# EasyEDA Pro project ProPrj_FOC Motor Driver _V02.epro, board V02
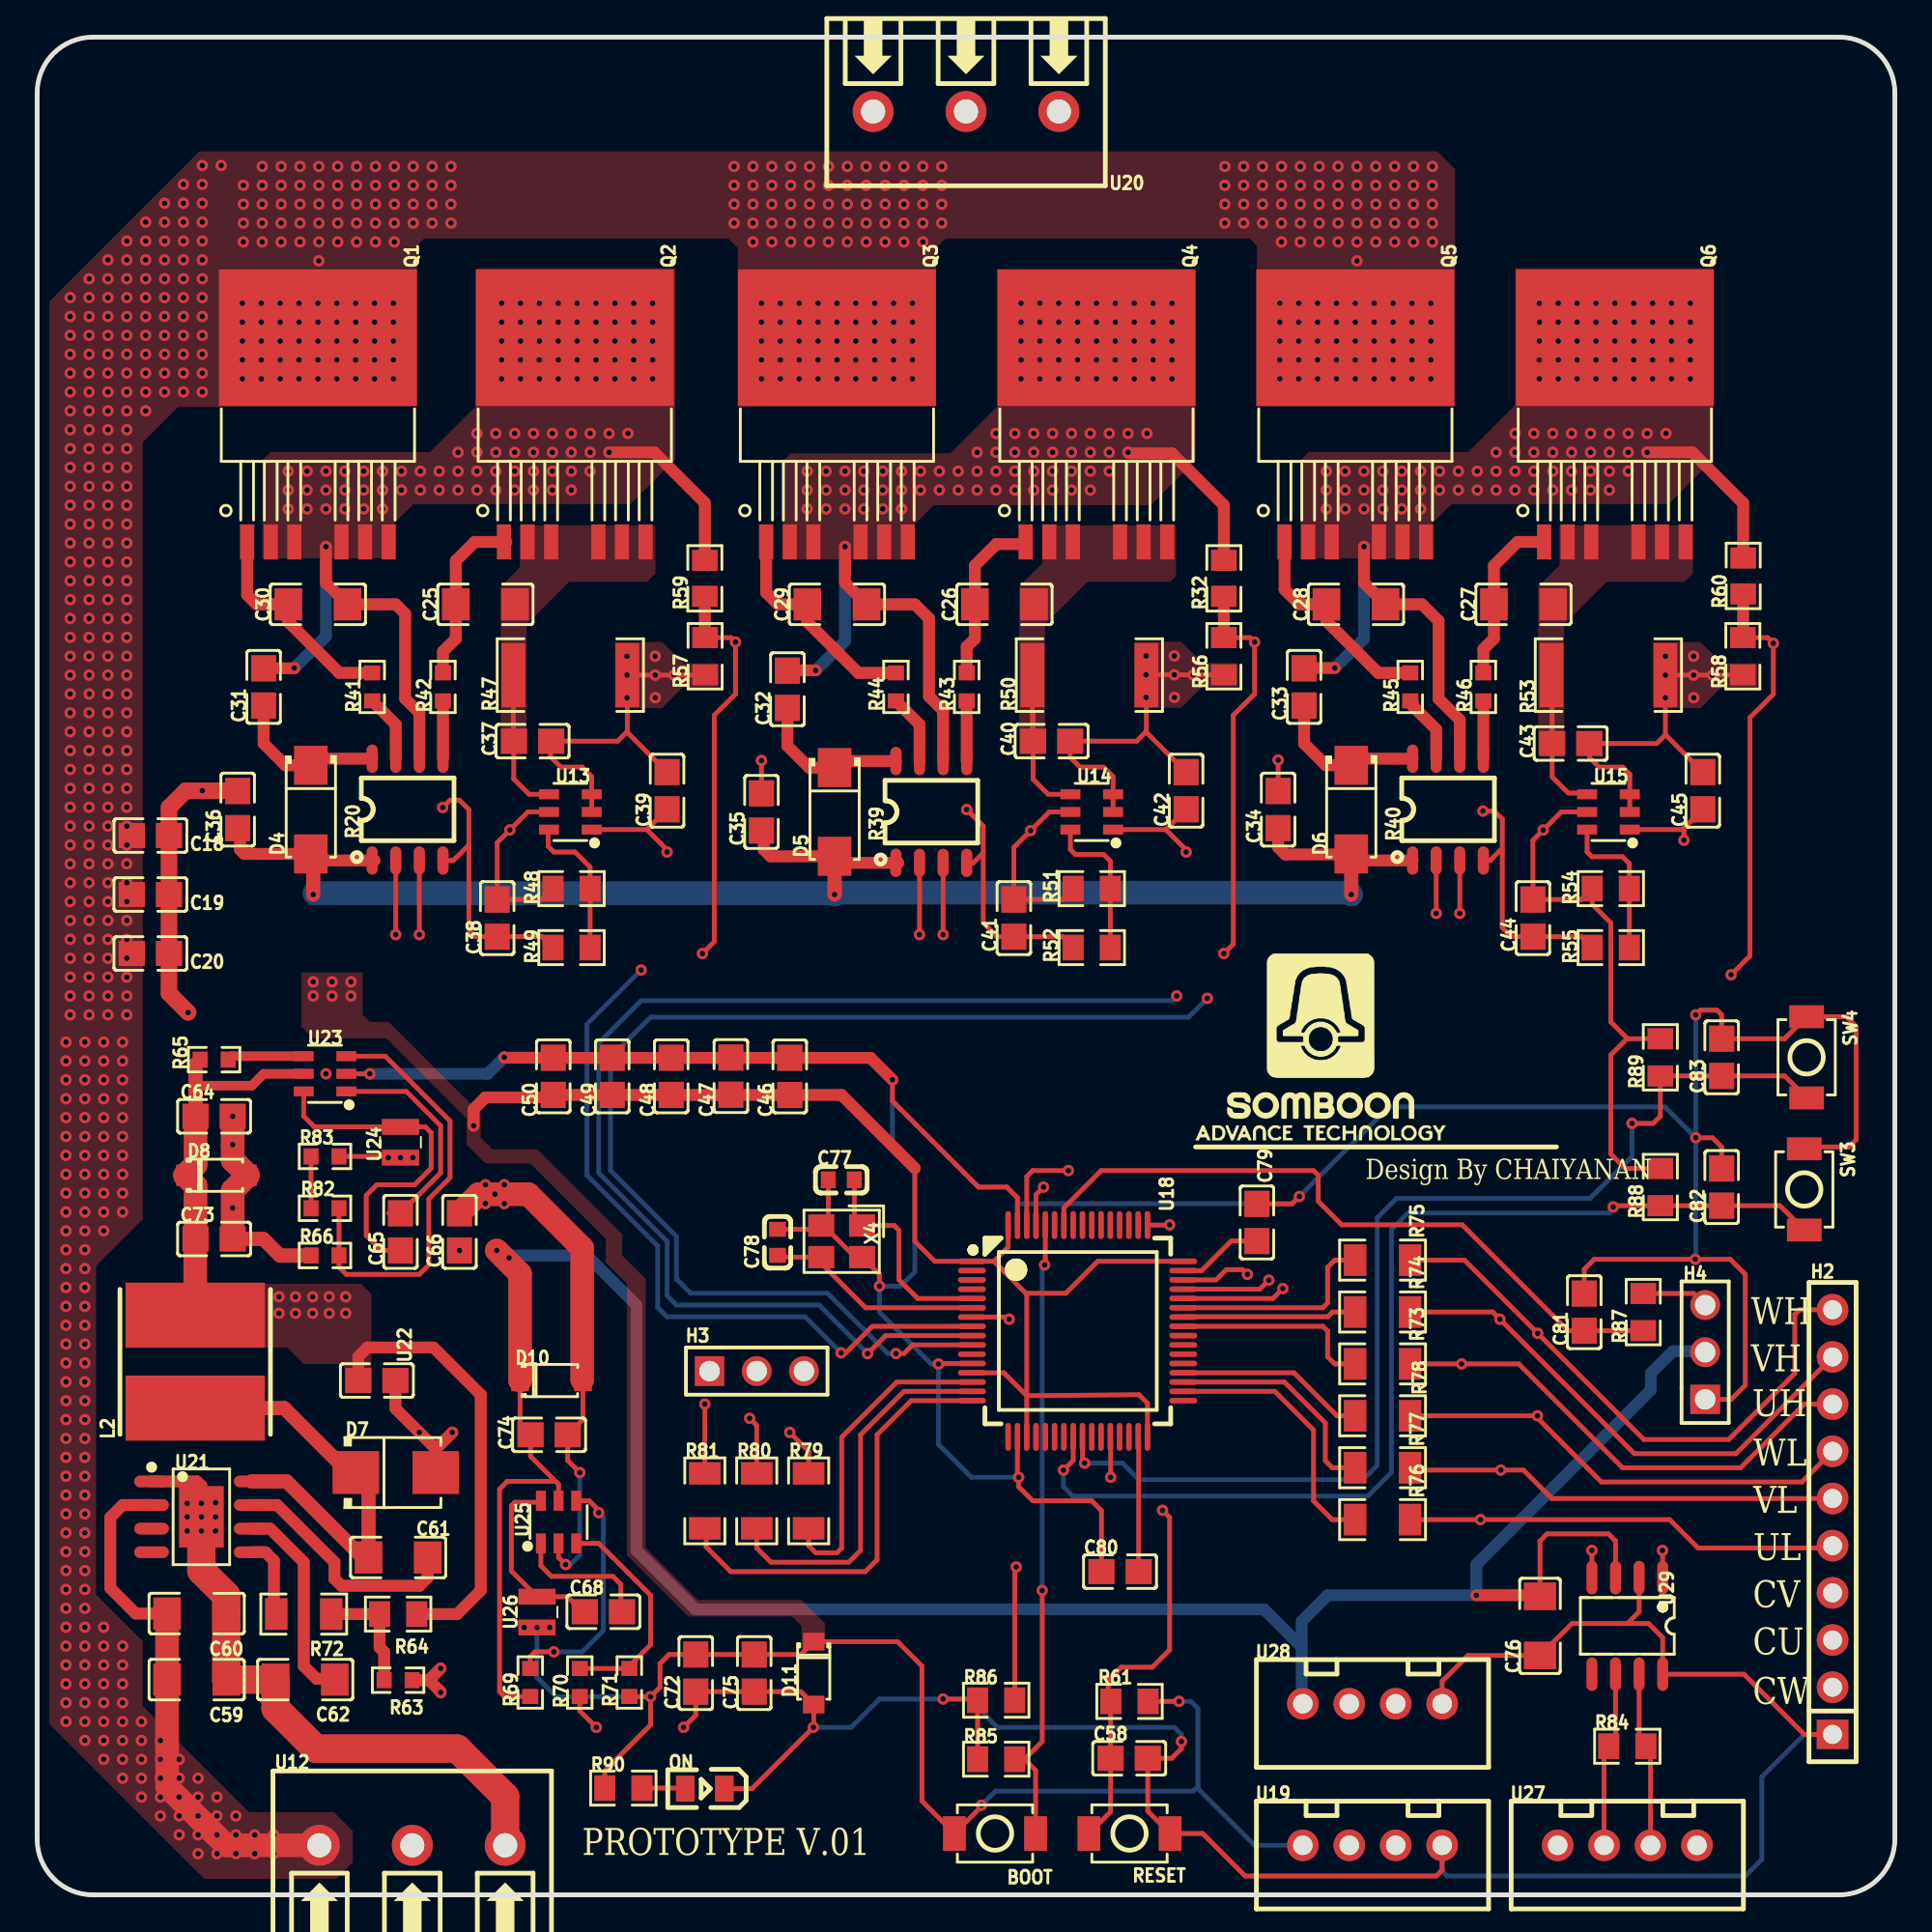
[diagram p10: board, top side]
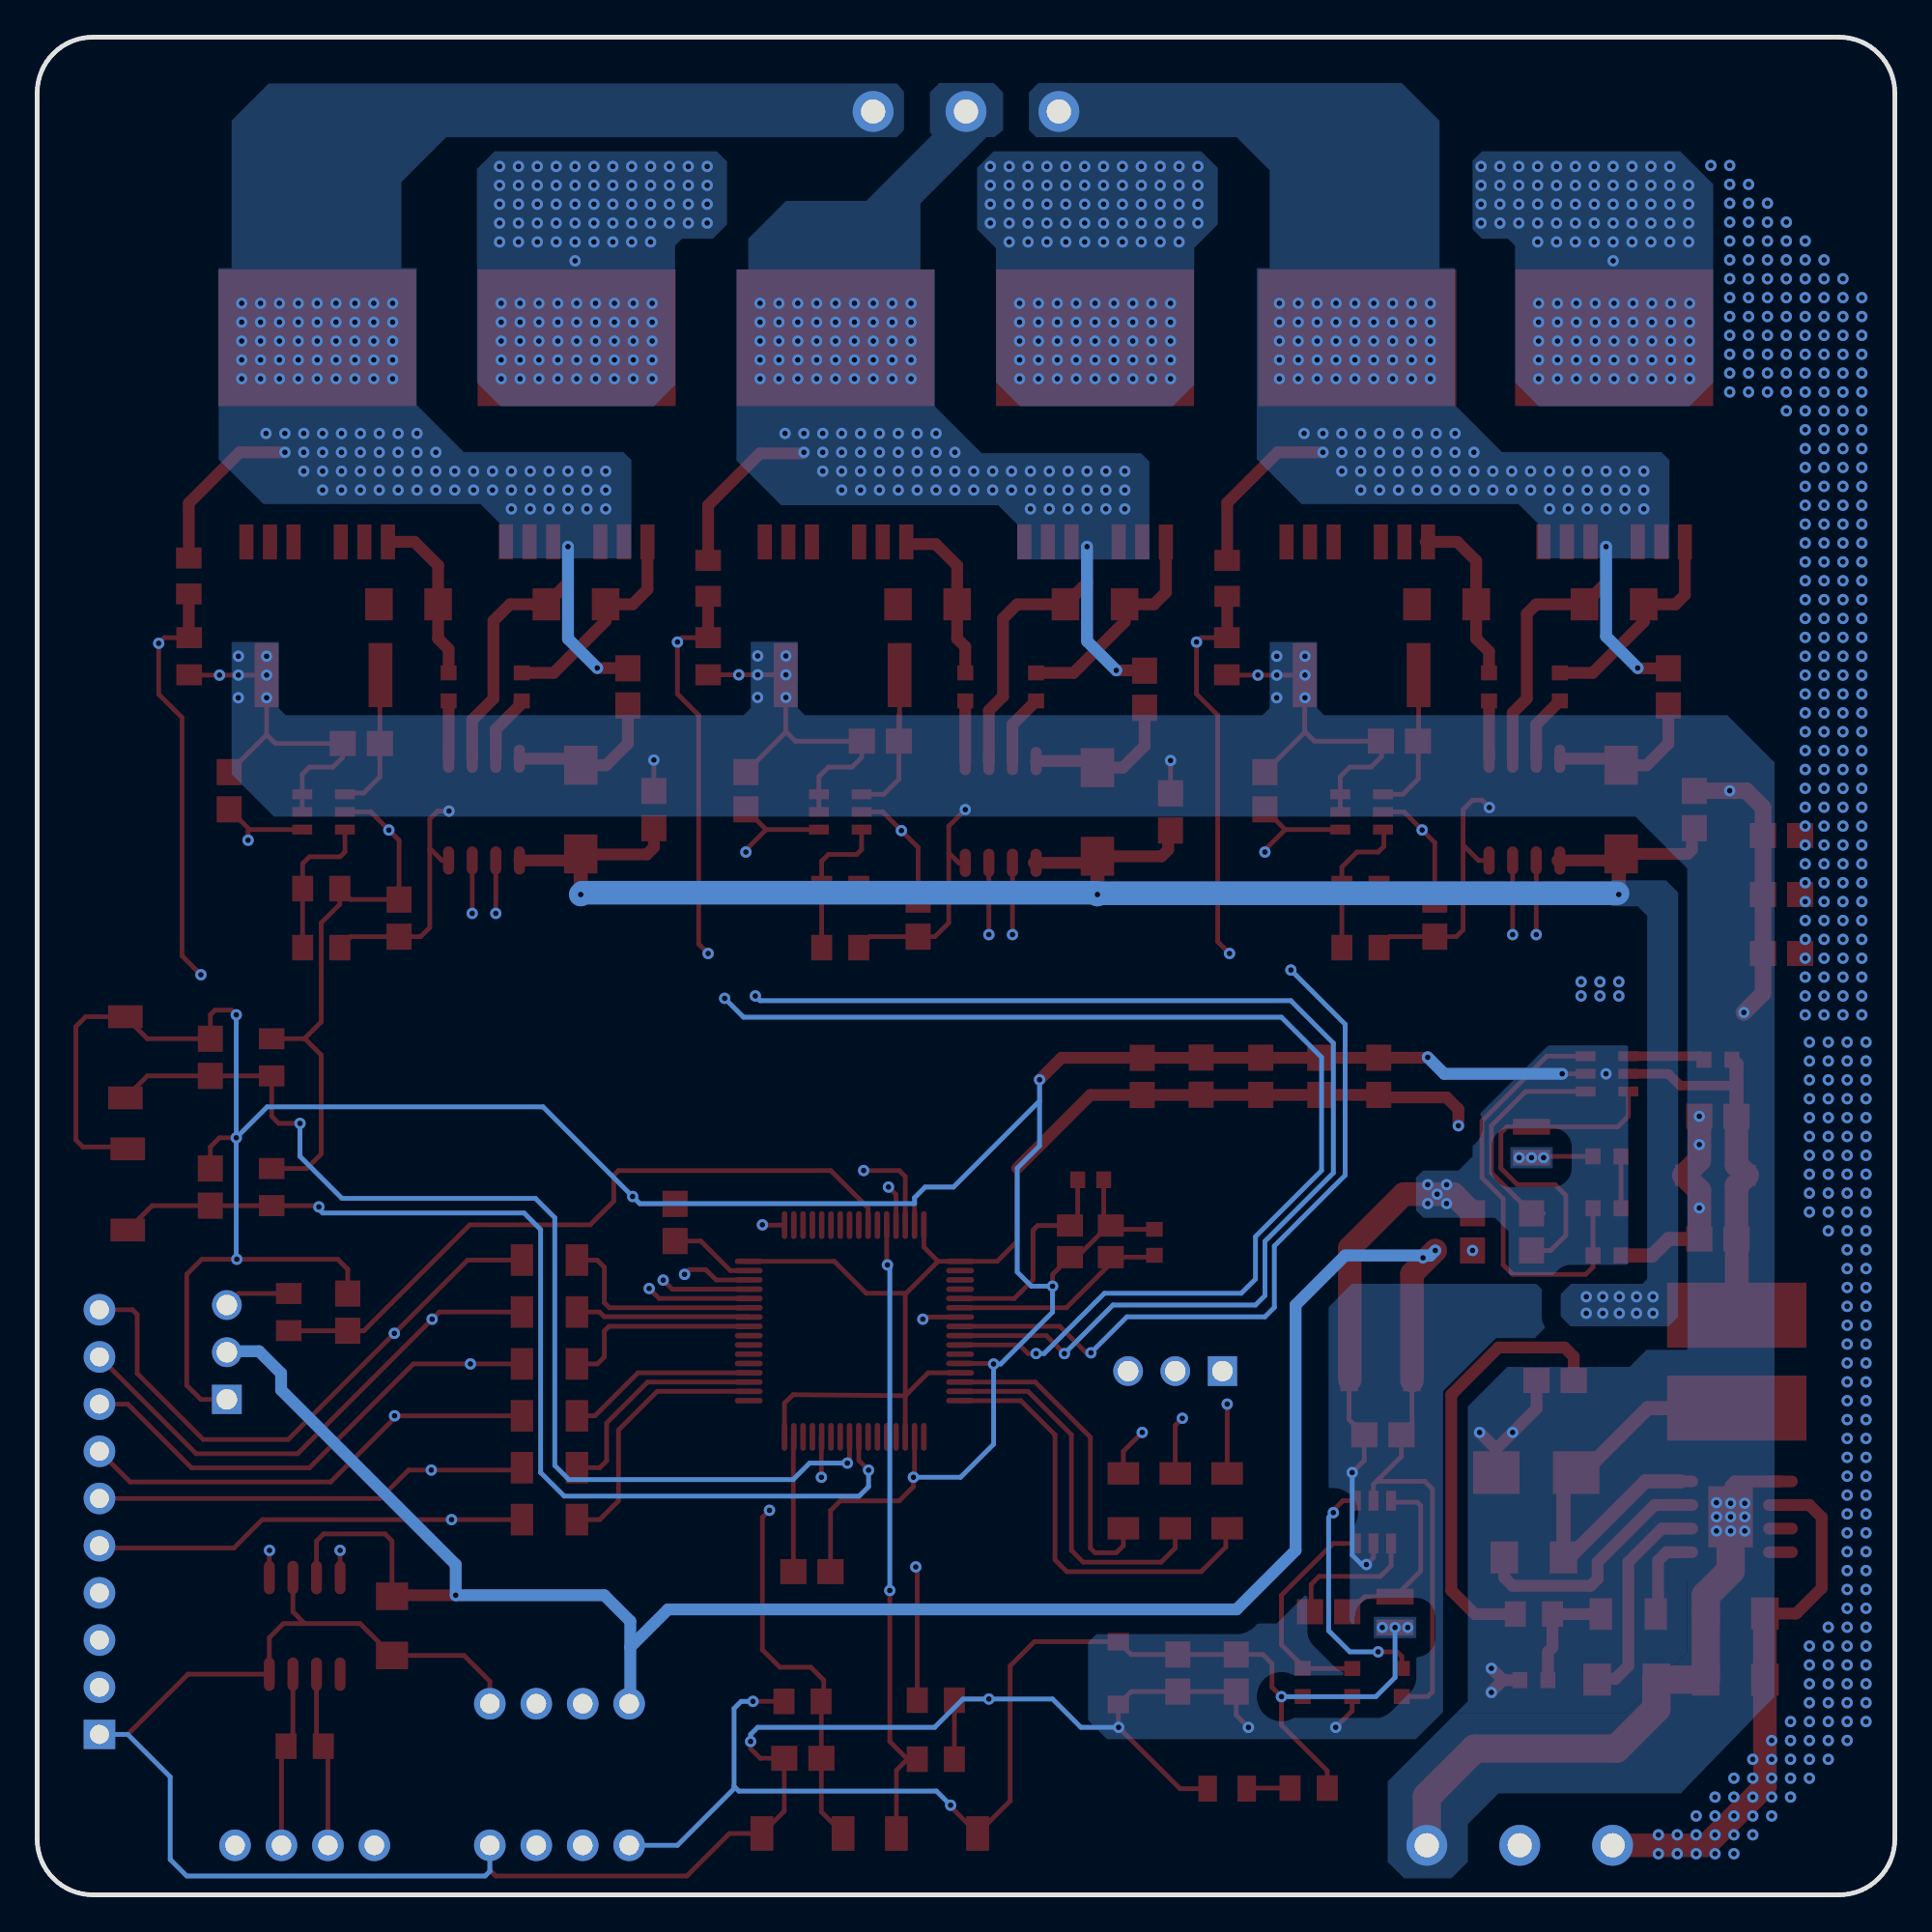
[diagram p11: board, bottom side, seen from below]

Outline 100 x 100 mm; copper layers: Top Layer, Inner1, Inner2, Bottom Layer. Coordinates in mm from the lower left corner of the outline.
Outline path: 0,97 0,3 arc(0.88,0.88) 3,0 97,0 arc(99.12,0.88) 100,3 100,97 arc(99.12,99.12) 97,100 3,100 arc(0.88,99.12) 0,97
Stack: Top Layer 0.012mm / Dielectric1 0.025mm FR4 er 4.5 / Inner1 0.035mm / Dielectric4 0.48mm PP er 4.5 / Inner2 0.035mm / Dielectric5 0.48mm PP er 4.5 / Bottom Layer 0.012mm

## Design rules (mm)
template: Custom Config
spacing copperThickness1oz (default): track to track 0.102, other pairs 0.152 to 0.3
spacing copperThickness2oz: track to track 0.203, other pairs 0.152 to 0.3
track width copperThickness1oz (default): min 0.127, default 0.254, max 2.54
track width copperThickness2oz: min 0.203, default 0.254, max 2.54
differential pair differentialPair (default): width min 0.127, default 0.254, max 2.54; gap min 0.152, default 0.152
via viaSize (default): diameter min 0.5, default 0.61, max 10; hole min 0.3, default 0.305, max 6.3

## Placement (name value [footprint] x y rotation side)
BOOT  TS-1088-AR02016  [SW-SMD_L3.9-W3.0-P4.45]  51.56 3.3 180 top
C18  2.2uF  [C0805]  6.1 57.02 180 top
C19  2.2uF  [C0805]  6.1 53.85 180 top
C20  2.2uF  [C0805]  6.1 50.67 180 top
C25  22nF  [C1206]  24.13 69.47 0 top
C26  22nF  [C1206]  52.07 69.47 0 top
C27  22nF  [C1206]  80.01 69.47 0 top
C28  22nF  [C1206]  70.99 69.47 0 top
C29  22nF  [C1206]  43.05 69.47 0 top
C30  22nF  [C1206]  15.11 69.47 0 top
C31  10uF  [C0805]  12.19 65.02 270 top
C32  10uF  [C0805]  40.39 64.9 270 top
C33  10uF  [C0805]  68.2 65.02 270 top
C34  10uF  [C0805]  66.8 58.42 270 top
C35  10uF  [C0805]  38.99 58.29 270 top
C36  10uF  [C0805]  10.8 58.42 270 top
C37  100nF  [C0805]  26.67 62.1 180 top
C38  100nF  [C0805]  24.77 52.58 90 top
C39  100nF  [C0805]  33.91 59.44 90 top
C40  100nF  [C0805]  54.61 62.1 180 top
C41  100nF  [C0805]  52.58 52.58 90 top
C42  100nF  [C0805]  61.85 59.44 90 top
C43  100nF  [C0805]  82.55 61.98 180 top
C44  100nF  [C0805]  80.52 52.58 90 top
C45  100nF  [C0805]  89.66 59.44 90 top
C46  1uF  [C0805]  40.51 44.06 270 top
C47  1uF  [C0805]  37.34 44.07 270 top
C48  1uF  [C0805]  34.13 44.06 270 top
C49  2.2uF  [C0805]  30.96 44.06 270 top
C50  1uF  [C0805]  27.78 44.06 270 top
C58  100nF  [C0805]  58.78 7.35 0 top
C59  100nF  [C1206]  8.59 11.59 180 top
C60  2.2uF  [C1206]  8.59 15.14 180 top
C61  100nF  [C1206]  19.43 18.16 180 top
C62  2.2uF  [C1206]  14.43 11.59 180 top
C64  4.7uF  [C0805]  9.53 41.91 180 top
C65  22nF  [C0805]  19.56 35.69 270 top
C66  4.7uF  [C0805]  22.73 35.69 270 top
C68  22nF  [C0805]  30.48 15.24 180 top
C72  1uF  [C0805]  35.45 11.94 90 top
C73  22uF  [C0805]  9.53 35.31 180 top
C74  22uF  [C0805]  27.56 24.76 180 top
C75  22uF  [C0805]  38.6 11.94 90 top
C76  2.2uF  [C1206]  80.9 14.48 90 top
C77  18pF  [C0603]  43.29 38.49 180 top
C78  18pF  [C0603]  39.86 35.13 90 top
C79  2.2uF  [C0805]  65.66 36.19 270 top
C80  2.2uF  [C0805]  58.29 17.4 0 top
C81  10nF  [C0805]  83.28 31.37 90 top
C82  100nF  [C0805]  90.68 38.1 270 top
C83  100nF  [C0805]  90.68 45.08 270 top
D4  FR107  [SMA_L4.2-W2.7-LS5.3-FD]  14.73 58.42 90 top
D5  FR107  [SMA_L4.2-W2.7-LS5.3-FD]  42.93 58.29 90 top
D6  FR107  [SMA_L4.2-W2.7-LS5.3-FD]  70.74 58.42 90 top
D7  SS510B  [SMB_L4.3-W3.6-LS5.3-RD]  19.3 22.73 0 top
D8  SMF12A  [SOD-123_L2.8-W1.8-LS3.7-RD]  9.65 38.73 0 top
D10  SMF5.0A  [SOD-123_L2.8-W1.8-LS3.7-RD]  27.69 27.69 0 top
D11  SMF3.3A  [SOD-123_L2.8-W1.8-LS3.7-RD]  41.8 11.94 270 top
H2  XY-PZ2.54V-01-10P  [HDR-TH_10P-P2.54-V-M_4]  96.65 20.07 90 top
H3  2.54-1*3P针  [HDR-TH_3P-P2.54-V-M-1]  38.74 28.19 0 top
H4  2.54-1*3P针  [HDR-TH_3P-P2.54-V-M-1]  89.79 29.21 90 top
L2  68uH  [IND-SMD_L7.8-W7.0_SCD0705N]  8.51 28.7 90 top
ON  KT-0805Y  [LED0805-R-RD]  35.94 5.72 180 top
Q1  IRFS7530TRL7PP  [D2PAK-7_L10.6-W9.6-P1.27-LS15.9-BR]  15.11 78.32 270 top
Q2  IRFS7530TRL7PP  [D2PAK-7_L10.6-W9.6-P1.27-LS15.9-BR]  28.94 78.32 270 top
Q3  IRFS7530TRL7PP  [D2PAK-7_L10.6-W9.6-P1.27-LS15.9-BR]  43.05 78.32 270 top
Q4  IRFS7530TRL7PP  [D2PAK-7_L10.6-W9.6-P1.27-LS15.9-BR]  57.02 78.32 270 top
Q5  IRFS7530TRL7PP  [D2PAK-7_L10.6-W9.6-P1.27-LS15.9-BR]  70.96 78.32 270 top
Q6  IRFS7530TRL7PP  [D2PAK-7_L10.6-W9.6-P1.27-LS15.9-BR]  84.93 78.32 270 top
R20  EG3112D  [SOP-8_L5.0-W3.9-P1.27-LS6.0-BL-1]  19.94 58.42 0 top
R32  56K  [R0805_NEW]  63.88 70.87 90 top
R39  EG3112D  [SOP-8_L5.0-W3.9-P1.27-LS6.0-BL-1]  48.13 58.29 0 top
R40  EG3112D  [SOP-8_L5.0-W3.9-P1.27-LS6.0-BL-1]  75.95 58.42 0 top
R41  10Ω  [R0603]  18.03 65.02 90 top
R42  10Ω  [R0603]  21.84 65.02 90 top
R43  10Ω  [R0603]  50.04 65.02 90 top
R44  10Ω  [R0603]  46.23 65.02 90 top
R45  10Ω  [R0603]  73.91 65.02 90 top
R46  10Ω  [R0603]  77.85 65.02 90 top
R47  1mΩ  [R2512]  28.7 65.66 180 top
R48  1kΩ  [R0805]  28.77 54.17 0 top
R49  1kΩ  [R0805]  28.77 50.99 0 top
R50  1mΩ  [R2512]  56.64 65.66 180 top
R51  1kΩ  [R0805]  56.77 54.17 0 top
R52  1kΩ  [R0805]  56.77 50.99 0 top
R53  1mΩ  [R2512]  84.58 65.66 180 top
R54  1kΩ  [R0805]  84.71 54.17 0 top
R55  1kΩ  [R0805]  84.71 50.99 0 top
R56  2.2kΩ  [R0805]  63.88 66.67 90 top
R57  2.2kΩ  [R0805]  35.96 66.67 90 top
R58  2.2kΩ  [R0805]  91.82 66.67 90 top
R59  56K  [R0805_NEW]  35.94 70.87 90 top
R60  56K  [R0805_NEW]  91.84 71 90 top
R61  10kΩ  [R0805]  58.8 10.41 180 top
R63  30kΩ  [R0603]  19.43 11.56 180 top
R64  274kΩ  [R0805]  19.43 15.11 0 top
R65  10kΩ  [R0603]  9.53 44.96 0 top
R66  10kΩ  [R0603]  15.49 34.42 0 top
R69  10kΩ  [R0603]  26.54 11.43 90 top
R70  10kΩ  [R0603]  29.21 11.43 90 top
R71  45.3kΩ  [R0603]  31.88 11.43 270 top
R72  5.1kΩ  [R1206]  14.35 15.11 0 top
R73  0Ω  [R1206]  72.42 28.58 180 top
R74  0Ω  [R1206]  72.42 31.38 180 top
R75  0Ω  [R1206]  72.42 34.17 180 top
R76  0Ω  [R1206]  72.42 20.2 180 top
R77  0Ω  [R1206]  72.42 22.99 180 top
R78  0Ω  [R1206]  72.42 25.79 180 top
R79  0Ω  [R1206]  41.53 21.21 270 top
R80  0Ω  [R1206]  38.74 21.21 270 top
R81  0Ω  [R1206]  35.94 21.21 270 top
R82  4.3kΩ  [R0603]  15.49 36.96 180 top
R83  73.2kΩ  [R0603]  15.49 39.75 0 top
R84  120Ω  [R0805]  85.6 8 0 top
R85  10kΩ  [R0805]  51.63 7.3 180 top
R86  10kΩ  [R0805]  51.63 10.48 180 top
R87  1kΩ  [R0805]  86.46 31.37 270 top
R88  10kΩ  [R0805]  87.38 38.1 270 top
R89  10kΩ  [R0805]  87.38 45.08 270 top
R90  1kΩ  [R0805]  31.56 5.75 180 top
RESET  TS-1088-AR02016  [SW-SMD_L3.9-W3.0-P4.45]  58.8 3.3 180 top
SW3  TS-1088-AR02016  [SW-SMD_L3.9-W3.0-P4.45]  95.12 37.97 270 top
SW4  TS-1088-AR02016  [SW-SMD_L3.9-W3.0-P4.45]  95.25 45.08 270 top
U12  1935174  [CONN-TH_3P-P5.00_1935174]  20.19 2.67 0 top
U13  INA181A1IDBVR  [SOT-23-6_L2.9-W1.6-P0.95-LS2.8-TL]  28.7 58.29 180 top
U14  INA181A1IDBVR  [SOT-23-6_L2.9-W1.6-P0.95-LS2.8-TL]  56.77 58.29 180 top
U15  INA181A1IDBVR  [SOT-23-6_L2.9-W1.6-P0.95-LS2.8-TL]  84.58 58.29 180 top
U18  STM32F405RGT6  [LQFP-64_L10.0-W10.0-P0.50-LS12.0-BL]  56.01 30.35 270 top
U19  xh2.54-4p(直针)  [CONN-TH_4P-P2.50-XH2.54-4P]  71.88 2.67 0 top
U20  1935174  [CONN-TH_3P-P5.00_1935174]  50 96 180 top
U21  SCT2A23STER  [ESOP-8_L4.9-W3.9-P1.27-LS6.0-BL-EP-1]  8.84 20.35 270 top
U22  68pF  [C0805]  18.29 27.69 180 top
U23  RY8120  [SOT-23-6_L2.9-W1.6-P0.95-LS2.8-BL]  15.49 44.2 90 top
U24  2.2uH  [IND-SMD_L2.5-W2.0-VLS252012CX-150M]  19.56 40.51 270 top
U25  RY8120  [SOT-23-6_L2.9-W1.6-P0.95-LS2.8-BL]  28.07 20.07 0 top
U26  2.2uH  [IND-SMD_L2.5-W2.0-VLS252012CX-150M]  26.91 15.22 270 top
U27  xh2.54-4p(直针)  [CONN-TH_4P-P2.50-XH2.54-4P]  85.6 2.67 0 top
U28  xh2.54-4p(直针)  [CONN-TH_4P-P2.50-XH2.54-4P]  71.88 10.29 0 top
U29  MCP2551-I/SN  [SOIC-8_L4.9-W3.9-P1.27-LS6.0-BL]  85.6 14.48 180 top
X4  8MHz  [CRYSTAL-SMD_4P-L3.2-W2.5-BL]  43.31 35.18 180 top

## Footprints (pads in the part's own frame, mm; a bottom-side part is the same pattern mirrored in y, then rotated)
C0603
  rect 0.8x0.9 smd: 1(-0.7,0) 2(0.7,0)
C0805
  rect 1.41x1.35 smd: 1(-1,0) 2(1,0)
C1206
  rect 1.485x1.728 smd: 1(-1.593,0) 2(1.593,0)
CONN-TH_3P-P5.00_1935174
  round 2.2 hole 1.3: 1(-5,0) 2(0,0) 3(5,0)
CONN-TH_4P-P2.50-XH2.54-4P
  round 1.7 hole 1.05: 1(3.75,0) 2(1.25,0) 3(-1.25,0) 4(-3.75,0)
CRYSTAL-SMD_4P-L3.2-W2.5-BL
  rect 1.4x1.2 smd: 1(-1.1,-0.85) 2(1.1,-0.85) 3(1.1,0.85) 4(-1.1,0.85)
D2PAK-7_L10.6-W9.6-P1.27-LS15.9-BR
  rect 1.887x0.762 smd: 1(5.495,-3.81) 2(5.495,-2.54) 3(5.495,-1.27) 5(5.495,1.27) 6(5.495,2.54) 7(5.495,3.81)
  rect 7.356x10.66 smd: 4(-5.495,0)
ESOP-8_L4.9-W3.9-P1.27-LS6.0-BL-EP-1
  oval 0.63x1.865 smd: 1(-1.905,-2.683) 2(-0.635,-2.683) 3(0.635,-2.683) 4(1.905,-2.683) 5(1.905,2.683) 6(0.635,2.683) 7(-0.635,2.683) 8(-1.905,2.683)
  rect 3.3x2.4 smd: 9(0,0)
HDR-TH_3P-P2.54-V-M-1
  rect 1.575x1.6 hole 1.1: 1(-2.54,0)
  round 1.6 hole 1.1: 2(0,0) 3(2.54,0)
HDR-TH_10P-P2.54-V-M_4
  rect 1.575x1.7 hole 1.02: 1(-11.43,0)
  round 1.7 hole 1.02: 2(-8.89,0) 3(-6.35,0) 4(-3.81,0) 5(-1.27,0) 6(1.27,0) 7(3.81,0) 8(6.35,0) 9(8.89,0) 10(11.43,0)
IND-SMD_L2.5-W2.0-VLS252012CX-150M
  rect 0.85x2 smd: 1(-0.83,0) 2(0.83,0)
IND-SMD_L7.8-W7.0_SCD0705N
  rect 3.5x7.5 smd: 1(-2.5,0) 2(2.5,0)
LED0805-R-RD
  rect 1x1.399 smd: 1(1.05,0) 2(-1.05,0)
LQFP-64_L10.0-W10.0-P0.50-LS12.0-BL
  oval 0.3x1.5 smd: 1(-3.75,-5.688) 2(-3.25,-5.688) 3(-2.75,-5.688) 4(-2.25,-5.688) 5(-1.75,-5.688) 6(-1.25,-5.688) 7(-0.75,-5.688) 8(-0.25,-5.688) 9(0.25,-5.688) 10(0.75,-5.688) 11(1.25,-5.688) 12(1.75,-5.688) 13(2.25,-5.688) 14(2.75,-5.688) 15(3.25,-5.688) 16(3.75,-5.688) 33(3.75,5.688) 34(3.25,5.688) 35(2.75,5.688) 36(2.25,5.688) 37(1.75,5.688) 38(1.25,5.688) 39(0.75,5.688) 40(0.25,5.688) 41(-0.25,5.688) 42(-0.75,5.688) 43(-1.25,5.688) 44(-1.75,5.688) 45(-2.25,5.688) 46(-2.75,5.688) 47(-3.25,5.688) 48(-3.75,5.688)
  oval 1.5x0.3 smd: 17(5.7,-3.738) 18(5.7,-3.238) 19(5.7,-2.738) 20(5.7,-2.238) 21(5.7,-1.738) 22(5.7,-1.238) 23(5.7,-0.739) 24(5.7,-0.238) 25(5.7,0.262) 26(5.7,0.762) 27(5.7,1.262) 28(5.7,1.762) 29(5.7,2.261) 30(5.7,2.762) 31(5.7,3.261) 32(5.7,3.762) 49(-5.7,3.762) 50(-5.7,3.261) 51(-5.7,2.762) 52(-5.7,2.261) 53(-5.7,1.762) 54(-5.7,1.262) 55(-5.7,0.762) 56(-5.7,0.262) 57(-5.7,-0.238) 58(-5.7,-0.739) 59(-5.7,-1.238) 60(-5.7,-1.738) 61(-5.7,-2.238) 62(-5.7,-2.738) 63(-5.7,-3.238) 64(-5.7,-3.738)
R0603
  rect 0.806x0.864 smd: 1(-0.753,0) 2(0.753,0)
R0805
  rect 1.133x1.377 smd: 1(-1,0) 2(1,0)
R0805_NEW
  rect 1.133x1.377 smd: 1(-0.966,0) 2(0.966,0)
R1206
  rect 1.208x1.701 smd: 1(-1.479,0) 2(1.479,0)
R2512
  rect 1.282x3.456 smd: 1(-3.067,0) 2(3.067,0)
SMA_L4.2-W2.7-LS5.3-FD
  rect 2.1x1.8 smd: 1(-2.386,0) 2(2.386,0)
SMB_L4.3-W3.6-LS5.3-RD
  rect 2.5x2.3 smd: 1(-2.15,0) 2(2.15,0)
SOD-123_L2.8-W1.8-LS3.7-RD
  rect 0.95x1.15 smd: 1(-1.692,0) 2(1.692,0)
SOIC-8_L4.9-W3.9-P1.27-LS6.0-BL
  oval 0.588x1.8 smd: 1(-1.905,-2.6) 2(-0.635,-2.6) 3(0.635,-2.6) 4(1.905,-2.6) 5(1.905,2.6) 6(0.635,2.6) 7(-0.635,2.6) 8(-1.905,2.6)
SOP-8_L5.0-W3.9-P1.27-LS6.0-BL-1
  oval 0.6x1.52 smd: 1(-1.905,-2.74) 2(-0.635,-2.74) 3(0.635,-2.74) 4(1.905,-2.74) 5(1.905,2.74) 6(0.635,2.74) 7(-0.635,2.74) 8(-1.905,2.74)
SOT-23-6_L2.9-W1.6-P0.95-LS2.8-BL
  rect 0.532x1.072 smd: 1(-0.95,-1.149) 2(0,-1.149) 3(0.95,-1.149) 4(0.95,1.149) 5(0,1.149) 6(-0.95,1.149)
SOT-23-6_L2.9-W1.6-P0.95-LS2.8-TL
  rect 1.072x0.532 smd: 1(-1.149,0.95) 2(-1.149,0) 3(-1.149,-0.95) 4(1.149,-0.95) 5(1.149,0) 6(1.149,0.95)
SW-SMD_L3.9-W3.0-P4.45
  rect 1.23x1.86 smd: 1(-2.185,0) 2(2.185,0)

## Nets
As in the schematic, except:
3.3V: BOOT.2 C38.2 C41.2 C44.2 C46.2 C47.2 C48.2 C49.2 C50.2 C72.2 C75.2 D11.1 R48.1 R51.1 R54.1 R61.1 R71.2 R88.1 R89.1 R90.2 U13.5 U14.5 U15.5 U18.1 U18.13 U18.19 U18.32 U18.48 U18.64 U19.4 U26.2
AGND: C18.1 C19.1 C20.1 C34.1 C35.1 C36.1 C37.1 C38.1 C39.2 C40.1 C41.1 C42.2 C43.1 C44.1 C45.2 C46.1 C47.1 C48.1 C49.1 C50.1 C58.2 C59.1 C60.1 C62.2 C64.1 C66.1 C72.1 C73.1 C74.1 C75.1 C76.1 C77.2 C78.2 C79.1 C80.1 C81.2 C82.1 C83.1 D7.2 D8.2 D10.2 D11.2 H2.1 H4.1 ON.2 R20.4 R39.4 R40.4 R47.1 R49.1 R50.1 R52.1 R53.1 R55.1 R56.1 R57.1 R58.1 R63.1 R66.1 R70.1 R85.2 R86.2 RESET.1 SW3.1 SW4.1 U12.3 U13.2 U13.3 U14.2 U14.3 U15.2 U15.3 U18.12 U18.18 U18.63 U19.1 U21.1 U21.9 U22.1 U23.2 U25.2 U28.1 U29.2 U29.8 X4.2 X4.4
BOOT: BOOT.1 R85.1 U18.60
RESET: C58.1 R61.2 RESET.2 U18.7
$2N11780: ON.1 R90.1

Pads without a net: U12 2; U18 2 3 4 11 17 20 21 22 23 26 27 29 30 33 37 38 39 40 50 51 52 53 54 55 56 57 59; U21 3 4; U27 1 4; U29 5

## Via types
v1: diameter 0.61, hole 0.305, Top Layer to Bottom Layer, 1126 vias

## Routing (per net, layer and track width the routed paths; a pad name or vN(x,y) marks a point on that pad's centre or on a via; arc(x,y) is an arc through that point)
3.3V: length 261.4
  Top Layer w0.254: 53.22,32.39 53.27,32.34 53.27,26.87 ; 53.22,32.39 51.5,34.1 ; 53.22,32.39 55.37,32.39 57.09,34.1 U18.48 ; 47.24,39.12 47.24,35.18 48.32,34.1 U18.1 51.5,34.1 ; R71.2 31.89,10.67 v1(33.02,10.67) ; 51.5,34.1 52.27,34.87 52.27,36.05 ; 85.61,46.08 85.58,46.08 84.71,45.21 84.71,39.88 85.49,39.1 R88.1 ; 85.61,46.08 84.71,46.99 84.71,52.32 83.71,53.32 R54.1 83.12,53.58 C44.2 80.52,56.77 v1(81.07,57.32) 82.04,58.29 U15.5 ; 85.61,46.08 R89.1 ; R51.1 55.18,53.58 C41.2 52.58,56.39 v1(53.48,57.29) 54.48,58.29 U14.5 ; 53.27,24.65 53.27,26.87 ; 53.27,26.87 59.31,26.92 59.77,26.46 59.77,24.65 ; 53.27,26.87 52.03,28.1 U18.13 ; v1(33.02,10.67) 33.53,11.18 33.53,12.45 34.02,12.94 C72.2 C75.2 41.11,12.94 D11.1 46.31,13.63 47.62,12.32 47.62,5.05 BOOT.2 50.83,4.76 v1(50.83,4.83) ; v1(33.02,10.67) 33.02,9.14 30.56,6.68 R90.2 ; R48.1 27.18,53.58 C38.2 24.77,56.64 v1(25.45,57.32) 26.42,58.29 U13.5 ; v1(61.47,10.41) R61.1
  Top Layer w0.635: v1(23.5,41.4) 23.5,42.29 24.13,42.93 27.65,42.93 C50.2 C49.2 C48.2 34.14,43.06 C46.2 43.3,43.06 47.24,39.12
  Inner2 w0.508: v1(81.07,57.32) 81.04,57.29 v1(53.48,57.29) 53.44,57.32 v1(25.45,57.32)
  Inner2 w0.889: v1(25.45,57.32) 19.99,57.32 15.88,53.21 15.88,49.29
  Bottom Layer w0.254: 62.48,5.84 62.23,5.59 51.59,5.59 v1(50.83,4.83) ; 62.48,5.84 62.48,5.72 65.53,2.67 U19.4 ; 62.48,5.84 62.48,10.03 62.1,10.41 v1(61.47,10.41) ; v1(33.02,10.67) 27.94,10.67 26.91,11.7 v1(26.91,14.39)
  vias: v1(14.86,49.15) v1(14.86,48.39) v1(15.88,49.15) v1(15.88,48.39) v1(16.89,49.15) v1(16.89,48.39) v1(26.22,14.39) v1(27.59,14.39)
12V: length 132.2
  Top Layer w0.508: 8.53,43.35 8.74,43.56 11.56,43.56 12.19,44.2 U23.5
  Top Layer w0.635: 10.92,57.42 10.92,56.26 11.15,56.03 D4.1 14.86,56.03 15.21,55.68 18.16,55.68 ; R64.2 22.61,15.11 23.88,16.38 23.88,26.92 21.34,29.46 17.78,29.46 17.29,28.97 U22.2 ; R40.1 71.09,55.68 D6.1 70.71,56.01 67.18,56.01 66.8,56.39 C34.2 ; 46.35,55.55 43.41,55.55 43.05,55.91 D5.1 39.47,55.91 39.12,56.26 39.12,57.29
  Top Layer w0.762: 14.86,55.91 v1(14.86,53.85) ; D6.1 v1(70.74,53.85) ; R65.1 8.53,44.71 C64.2 ; D5.1 v1(42.93,53.85)
  Top Layer w1.27: L2.2 8.51,35.29 C73.2 8.53,38.17 D8.1 8.53,39.3 C64.2
  Bottom Layer w1.27: 14.93,53.92 42.86,53.92 v1(42.93,53.85) 43.02,53.95 70.64,53.95 v1(70.74,53.85)
  vias: v1(13.02,32.19) v1(13.02,31.31) v1(13.91,32.19) v1(13.91,31.31) v1(14.83,32.19) v1(14.83,31.31) v1(15.72,32.19) v1(15.72,31.31) v1(16.61,32.19) v1(16.61,31.31)
+5V: length 149.5
  Top Layer w0.254: v1(19.56,39.68) 19.49,39.75 R83.2 ; C76.2 80.9,19.05 81.28,19.43 84.58,19.43 84.96,19.05 U29.3 ; 27.91,22.26 25.31,22.26 24.89,21.84 24.89,10.93 25.15,10.68 R69.1 ; 27.91,22.26 26.56,23.61 C74.2 25.99,25.33 D10.1 ; 27.91,22.26 28.07,22.1 U25.5
  Top Layer w0.635: v1(77.47,16.13) 80.84,16.13 C76.2
  Top Layer w1.27: D10.1 25.99,33.43 v1(24.74,34.69)
  Inner2 w1.524: 19.56,39.62 19.56,37.47 22.34,34.69 v1(22.73,34.69) v1(24.74,34.69)
  Bottom Layer w0.635: H4.2 89.74,29.26 88.05,29.26 86.87,28.08 86.87,27.18 77.47,17.78 v1(77.47,16.13) 69.47,16.13 68.07,14.73 68.07,13.34 ; 68.07,13.34 68.07,9.84 68.13,9.78 ; 68.07,13.34 66.04,15.37 35.43,15.37 32.26,18.54 32.26,31.75 29.59,34.42 25.01,34.42 v1(24.74,34.69)
  vias: v1(18.91,39.68) v1(20.22,39.68) v1(25.4,34.29)
AGND: length 538.8
  Top Layer w0.254: X4.2 42,35.83 C78.2 ; X4.2 42.33,36.03 44.03,34.33 44.41,34.33 45.34,33.4 v1(45.34,32.77) ; X4.2 42.59,36.41 C77.2 ; 83.57,61.96 83.57,61.21 84.07,60.71 85.34,60.71 85.73,60.32 U15.3 U15.2 ; 83.57,61.96 C43.1 83.57,61.98 ; 83.57,61.96 83.57,61.98 ; v1(21.83,58.53) 22.22,58.93 22.73,58.93 23.24,58.42 23.24,56.52 ; U13.2 U13.3 29.85,60.19 29.34,60.71 28.19,60.71 27.63,61.27 27.63,62.07 ; R70.1 29.21,9.91 v1(30.1,9.02) ; C82.1 90.68,40.26 90.18,40.75 v1(89.28,40.75) ; C37.1 31.24,62.1 31.77,62.63 ; 50.93,56.09 50.93,52.32 51.67,51.58 C41.1 55.18,51.58 R52.1 ; 50.93,56.09 50.93,57.53 v1(50.04,58.42) ; 50.93,56.09 50.39,55.55 50.04,55.55 ; C45.2 87.65,62.45 ; 87.65,62.45 v1(87.65,64.44) 87.65,65.53 ; 87.65,62.45 87.17,61.98 83.57,61.98 ; C39.2 31.77,62.58 31.77,62.63 ; C80.1 57.29,20.69 56.77,21.21 53.59,21.21 52.83,21.97 v1(52.83,22.48) 52.77,22.54 52.77,24.65 ; 31.77,62.63 R47.1 35.91,65.66 35.96,65.71 ; U14.2 U14.3 57.92,60.19 57.4,60.71 56.13,60.71 55.61,61.23 ; C35.1 v1(38.99,61.06) ; R85.2 R86.2 50.56,10.54 v1(48.77,10.54) ; C42.2 59.71,62.58 59.71,62.63 ; 59.71,62.63 59.18,62.1 C40.1 55.61,61.36 ; 59.71,62.63 R50.1 59.72,65.67 ; v1(17.91,44.2) U23.2 ; 78.87,56.23 78.77,56.23 78.21,55.68 R40.4 ; 78.87,56.23 78.87,52.07 79.36,51.58 C44.1 83.12,51.58 R55.1 ; 78.87,56.23 78.87,57.91 78.44,58.34 v1(77.83,58.34) ; 21.45,23.99 D7.2 ; v1(34.8,9.02) 35.45,9.67 C72.1 C75.1 41.11,10.94 D11.2 41.8,9.04 v1(41.78,9.02) 38.48,5.72 ON.2 ; H2.1 95.12,8.64 91.88,11.88 U29.8 87.5,13.84 86.74,14.6 85.6,14.6 ; 52.77,36.05 52.77,37.53 52.2,38.1 50.67,38.1 46.04,42.73 v1(46.04,43.88) ; v1(29.21,22.73) 28.56,23.38 C74.1 29.38,25.58 D10.2 ; v1(87.65,65.66) 91.66,65.66 91.82,65.82 ; v1(28.45,17.78) 28.07,18.16 U25.2 ; H4.1 91.19,26.67 91.95,27.43 91.95,33.4 91.13,34.22 v1(89.25,34.22) 83.82,34.22 83.28,33.68 83.28,32.36 ; U19.1 75.63,1.34 75.31,1.02 65.02,1.02 62.74,3.3 RESET.1 59.78,4.5 C58.2 61.07,7.35 61.59,7.87 v1(61.59,8.25) ; v1(67.94,37.59) 67.55,37.19 C79.1 ; 85.6,14.6 82.62,14.6 C76.1 77.02,12.89 75.63,11.5 75.63,9.78 ; 85.6,14.6 86.23,15.24 U29.2 ; v1(66.8,61.09) C34.1 ; R20.4 22.41,55.68 23.24,56.52 ; 23.24,56.52 23.24,51.94 23.61,51.58 C38.1 27.18,51.58 R49.1 ; v1(48.51,28.57) 48.54,28.6 U18.12 ; 25.15,37.08 25.02,37.21 ; v1(89.28,47.37) 89.53,47.62 90.42,47.62 90.68,47.37 C83.1 94.06,46.08 SW4.1 97.38,47.27 97.92,46.74 97.92,40.64 97.54,40.26 95.22,40.26 SW3.1 ; R56.1 59.98,65.67
  Top Layer w0.635: 21.08,11.56 v1(21.72,12.19) ; 21.08,11.56 R63.1 ; 21.08,11.56 21.1,11.56 21.72,10.94 v1(21.72,10.9) ; v1(8.84,20.35) 8.84,22.02 8.61,22.25 U21.1 ; v1(22.35,24.89) 21.45,23.99 ; v1(25.15,45.08) 25.17,45.06 C50.1 27.79,45.06 C46.1 44.86,45.06 v1(46.04,43.88) ; 21.45,24.01 v1(20.57,24.89) 19.29,26.18 U22.1
  Top Layer w0.762: R66.1 13.06,34.42 12.18,35.31 C73.1
  Top Layer w0.889: C36.1 10.78,59.44 v1(8.89,59.44) 8,59.44 7.1,58.53 C18.1 C19.1 C20.1 7.1,48.53 v1(8.13,47.5)
  Top Layer w1.27: C73.1 v1(10.53,36.97) 10.53,37.92 D8.2 10.53,39.55 v1(10.53,40.39) v1(10.53,41.91) ; C66.1 23.77,37.72 v1(24.64,37.72) 26.43,37.72 29.34,34.82 29.34,27.73
  Top Layer w1.524: U12.3 25.19,5.29 22.61,7.87 14.99,7.87 12.84,10.02 C62.2 C59.1 C60.1 10.18,16.11 8.84,17.45 v1(8.84,19.59) v1(8.84,20.35)
  Inner2 w1.524: v1(17.91,44.2) v1(15.55,44.2) 12.81,44.2 v1(10.53,41.91)
  Bottom Layer w0.254: H2.1 95.12,8.64 92.84,6.35 92.84,1.91 91.95,1.02 75.89,1.02 75.63,1.27 U19.1 ; v1(61.59,8.25) 61.59,8.64 61.21,9.02 51.69,9.02 50.16,10.54 v1(48.77,10.54) 45.34,10.54 43.81,9.02 v1(41.78,9.02) ; v1(89.28,40.75) 87.62,42.42 72.77,42.42 v1(67.94,37.59) 67.56,37.21 52.77,37.21 52.77,37.53 52.2,38.1 50.67,38.1 46.04,42.73 ; v1(89.28,40.75) v1(89.28,47.37) ; v1(89.28,40.75) 89.28,34.24 v1(89.25,34.22) ; 46.04,42.73 v1(46.04,43.88) ; 46.04,42.73 46.04,40.32 47.24,39.12 47.24,33.53 46.48,32.77 v1(45.34,32.77) 45.34,31.37 48.13,28.57 v1(48.51,28.57) 48.51,24.26 50.29,22.48 v1(52.83,22.48) ; v1(28.45,17.78) 28.7,17.78 29.21,18.29 v1(29.21,22.73)
  Bottom Layer w0.635: v1(17.91,44.2) 24.26,44.2 v1(25.15,45.08)
  vias: v1(8.08,21.08) v1(8.08,20.35) v1(8.08,19.59) v1(8.84,21.08) v1(9.6,21.11) v1(9.6,20.35) v1(9.6,19.59) v1(24.13,38.23) v1(24.13,37.21) v1(25.15,38.23) v1(25.15,37.21) v1(31.75,66.67) v1(31.75,65.66) v1(31.75,64.44) v1(33.27,66.67) v1(33.27,65.66) v1(33.28,64.44) v1(34.29,65.66) v1(59.7,66.69) v1(59.7,65.67) v1(59.7,64.46) v1(61.21,66.69) v1(61.21,65.67) v1(61.22,64.46) v1(62.23,65.67) v1(87.65,66.67) v1(89.17,66.67) v1(89.17,65.66) v1(89.17,64.44) v1(90.18,65.66)
BOOT: length 34
  Top Layer w0.254: R85.1 53.15,7.3 ; 53.15,7.3 53.75,6.71 BOOT.1 ; 53.15,7.3 54.1,8.25 v1(54.1,16.38) ; v1(54.23,33.91) 54.27,33.95 54.27,36.05
  Bottom Layer w0.254: v1(54.1,16.38) 54.1,33.78 v1(54.23,33.91)
CLK: length 49
  Top Layer w0.254: 59.77,36.05 60.94,36.05 v1(60.96,36.07)
  Inner1 w0.254: U19.2 73.13,1.38 72.77,1.02 65.02,1.02 63.88,2.16 63.88,35.69 63.5,36.07 v1(60.96,36.07)
CUR1: length 7.9
  Top Layer w0.254: 25.64,62.14 25.65,62.12 ; 25.64,62.14 R47.2 ; 25.64,62.14 25.64,62.12 ; 25.65,62.12 C37.2 25.65,62.09 ; 25.65,62.12 25.65,62.09 ; U13.4 26.48,59.24 25.65,60.07 25.65,62.09
CUR2: length 9.4
  Top Layer w0.254: U14.4 54.42,59.24 53.61,60.06 53.61,61.98 ; 53.58,63.63 53.58,62.14 C40.2 53.61,63.5 53.58,63.63 ; 53.58,63.63 R50.2
CUR3: length 7.6
  Top Layer w0.254: 81.52,65.53 81.55,65.5 C43.2 81.55,60.18 82.42,59.31 83.37,59.31 U15.4
CURRENT_U: length 118.7
  Top Layer w0.254: U18.8 44.95,30.6 43.53,29.18 v1(43.28,29.18) ; v1(33.91,56.13) 33.91,56.25 32.82,57.34 ; C39.1 32.82,57.34 ; 32.82,57.34 U13.1
  Inner1 w0.254: v1(32.51,49.78) 33.91,51.18 v1(33.91,56.13)
  Inner2 w0.254: v1(43.28,29.18) 43.31,29.15 43.31,20.07 49.91,13.46 92.84,13.46 95.12,11.18 H2.2
  Bottom Layer w0.254: v1(32.51,49.78) 29.59,46.86 29.59,38.73 33.4,34.92 33.4,31.62 33.91,31.12 41.34,31.12 v1(43.28,29.18)
CURRENT_V: length 143.4
  Top Layer w0.254: 60.76,57.34 U14.1 ; 60.76,57.34 61.85,56.25 v1(61.85,56.13) ; 60.76,57.34 C42.1 ; v1(44.7,29.13) 45.67,30.1 U18.9
  Inner1 w0.254: v1(61.34,48.39) 61.85,48.89 v1(61.85,56.13)
  Inner2 w0.254: v1(44.7,29.13) 44.32,28.75 44.32,20.32 50.29,14.35 94.49,14.35 95.12,13.72 H2.3
  Bottom Layer w0.254: v1(44.7,29.13) 42.09,31.75 34.42,31.75 33.91,32.26 33.91,35.18 30.23,38.86 30.23,45.85 32.51,48.13 61.09,48.13 v1(61.34,48.39)
CURRENT_W: length 166.1
  Top Layer w0.254: U18.10 47.13,29.6 46.66,29.14 v1(46.23,29.14) ; C45.1 88.57,57.34 ; 88.57,57.34 U15.1 ; 88.57,57.34 88.65,57.27 v1(88.65,56.77)
  Inner1 w0.254: v1(88.65,56.77) 88.65,56.26 88.26,55.88 63.88,55.88 62.99,54.99 v1(62.99,48.26)
  Inner2 w0.254: v1(46.23,29.14) 45.21,28.12 45.21,20.57 50.55,15.24 95,15.24 96.01,16.26 H2.4
  Bottom Layer w0.254: v1(46.23,29.14) 45.79,29.14 42.54,32.39 35.18,32.39 34.42,33.15 34.42,35.43 30.86,38.99 30.86,45.08 33.02,47.24 61.98,47.24 v1(62.99,48.26)
DIO: length 39
  Top Layer w0.254: U18.46 63.46,33.1 64.01,33.66 64.9,33.66 v1(65.15,33.4)
  Inner1 w0.254: U19.3 70.63,4.17 69.85,4.95 66.04,4.95 65.15,5.84 v1(65.15,33.4)
DP+: length 38.9
  Top Layer w0.254: U18.45 65.81,32.6 v1(66.3,33.09)
  Inner1 w0.254: v1(66.3,33.09) 69.53,36.32 72.14,36.32 72.88,35.58 72.88,12.09 73.13,11.83 73.13,9.78
DP-: length 38
  Top Layer w0.254: v1(67.06,32.64) 66.52,32.1 U18.44
  Inner1 w0.254: v1(67.06,32.64) 69.98,35.56 71.63,35.56 72.14,35.05 72.14,12.45 70.63,10.94 70.63,9.78
PC4: length 57.7
  Top Layer w0.254: v1(55.25,22.86) 55.77,23.38 55.77,24.65 ; SW3.2 93.81,37.1 C82.2 R88.2 84.9,37.1 v1(84.84,37.03)
  Bottom Layer w0.254: v1(84.84,37.03) 84.84,36.91 84.63,36.7 73.79,36.7 72.9,35.81 72.9,22.73 71.63,21.46 55.75,21.46 55.25,21.97 v1(55.25,22.86)
PC5: length 60.3
  Top Layer w0.254: v1(85.85,41.53) 86.99,41.53 87.38,41.91 R89.2 C83.2 94.06,44.08 SW4.2 ; 56.27,24.65 56.27,23.36 v1(56.39,23.24)
  Bottom Layer w0.254: v1(56.39,23.24) 58.42,23.24 59.31,22.35 71.37,22.35 72.14,23.11 72.14,36.45 73.18,37.49 83.59,37.49 85.85,39.75 v1(85.85,41.53)
PHASE_U: length 33.3
  Top Layer w0.635: C31.1 13.83,66.02 v1(13.84,66.04) ; v1(15.55,72.57) 15.55,70.63 C30.2 19.3,69.47 19.81,68.96 19.81,64.39 20.57,63.63 R20.6 ; R59.2 35.94,74.93 33.22,77.65 v1(30.78,77.65)
  Bottom Layer w0.635: v1(13.84,66.04) 15.55,67.74 v1(15.55,72.57)
  vias: v1(13.51,76.64) v1(13.51,75.62) v1(13.51,74.6) v1(14.53,76.64) v1(14.53,75.62) v1(14.53,74.6) v1(15.55,76.64) v1(15.55,75.62) v1(15.55,74.6) v1(16.56,76.64) v1(16.56,75.62) v1(16.56,74.6) v1(17.58,76.64) v1(17.58,75.62) v1(17.58,74.6) v1(18.59,76.64) v1(18.59,75.62) v1(18.59,74.6) v1(19.61,76.64) v1(19.61,75.62) v1(20.62,76.64) v1(20.62,75.62) v1(21.64,76.64) v1(21.64,75.62) v1(22.66,77.65) v1(22.66,76.64) v1(22.66,75.62) v1(23.67,78.67) v1(23.67,77.65) v1(23.67,76.64) v1(23.67,75.62) v1(24.69,78.67) v1(24.69,77.65) v1(24.69,76.64) v1(24.69,75.62) v1(25,85.67) v1(25,84.66) v1(25,83.64) v1(25,82.63) v1(25,81.61) v1(25.7,78.67) v1(25.7,77.65) v1(25.7,76.64) v1(25.7,75.62) v1(26.02,85.67) v1(26.02,84.66) v1(26.02,83.64) v1(26.02,82.63) v1(26.02,81.61) v1(26.72,78.67) v1(26.72,77.65) v1(26.72,76.64) v1(26.72,75.62) v1(27.03,85.67) v1(27.03,84.66) v1(27.03,83.64) v1(27.03,82.63) v1(27.03,81.61) v1(27.74,78.67) v1(27.74,77.65) v1(27.74,76.64) v1(27.74,75.62) v1(28.05,85.67) v1(28.05,84.66) v1(28.05,83.64) v1(28.05,82.63) v1(28.05,81.61) v1(28.75,78.67) v1(28.75,77.65) v1(28.75,76.64) v1(28.75,75.62) v1(29.07,85.67) v1(29.07,84.66) v1(29.07,83.64) v1(29.07,82.63) v1(29.07,81.61) v1(29.77,78.67) v1(29.77,77.65) v1(29.77,76.64) v1(30.08,85.67) v1(30.08,84.66) v1(30.08,83.64) v1(30.08,82.63) v1(30.08,81.61) v1(30.78,78.67) v1(31.1,85.67) v1(31.1,84.66) v1(31.1,83.64) v1(31.1,82.63) v1(31.1,81.61) v1(31.8,78.67) v1(32.11,85.67) v1(32.11,84.66) v1(32.11,83.64) v1(32.11,82.63) v1(32.11,81.61) v1(33.13,85.67) v1(33.13,84.66) v1(33.13,83.64) v1(33.13,82.63) v1(33.13,81.61)
PHASE_V: length 33.4
  Top Layer w0.635: R32.2 63.88,74.8 61.09,77.6 58.78,77.6 v1(58.72,77.65) ; R39.6 48.77,63.75 48.01,64.52 48.01,68.71 47.24,69.47 C29.2 43.49,70.63 v1(43.49,72.57) ; C32.1 40.4,65.91 v1(41.91,65.91)
  Bottom Layer w0.635: v1(41.91,65.91) 43.49,67.49 v1(43.49,72.57)
  vias: v1(41.45,76.64) v1(41.45,75.62) v1(41.45,74.6) v1(42.47,76.64) v1(42.47,75.62) v1(42.47,74.6) v1(43.49,76.64) v1(43.49,75.62) v1(43.49,74.6) v1(44.5,76.64) v1(44.5,75.62) v1(44.5,74.6) v1(45.52,76.64) v1(45.52,75.62) v1(45.52,74.6) v1(46.53,76.64) v1(46.53,75.62) v1(46.53,74.6) v1(47.55,76.64) v1(47.55,75.62) v1(48.56,76.64) v1(48.56,75.62) v1(49.58,76.64) v1(49.58,75.62) v1(50.6,77.65) v1(50.6,76.64) v1(50.6,75.62) v1(51.61,78.67) v1(51.61,77.65) v1(51.61,76.64) v1(51.61,75.62) v1(52.63,78.67) v1(52.63,77.65) v1(52.63,76.64) v1(52.63,75.62) v1(52.96,85.67) v1(52.96,84.66) v1(52.96,83.64) v1(52.96,82.63) v1(52.96,81.61) v1(53.65,78.67) v1(53.65,77.65) v1(53.65,76.64) v1(53.65,75.62) v1(53.97,85.67) v1(53.97,84.66) v1(53.97,83.64) v1(53.97,82.63) v1(53.97,81.61) v1(54.66,78.67) v1(54.66,77.65) v1(54.66,76.64) v1(54.66,75.62) v1(54.99,85.67) v1(54.99,84.66) v1(54.99,83.64) v1(54.99,82.63) v1(54.99,81.61) v1(55.68,78.67) v1(55.68,77.65) v1(55.68,76.64) v1(55.68,75.62) v1(56.01,85.67) v1(56.01,84.66) v1(56.01,83.64) v1(56.01,82.63) v1(56.01,81.61) v1(56.69,78.67) v1(56.69,77.65) v1(56.69,76.64) v1(56.69,75.62) v1(57.02,85.67) v1(57.02,84.66) v1(57.02,83.64) v1(57.02,82.63) v1(57.02,81.61) v1(57.71,78.67) v1(57.71,77.65) v1(57.71,76.64) v1(58.04,85.67) v1(58.04,84.66) v1(58.04,83.64) v1(58.04,82.63) v1(58.04,81.61) v1(58.72,78.67) v1(59.06,85.67) v1(59.06,84.66) v1(59.06,83.64) v1(59.06,82.63) v1(59.06,81.61) v1(59.74,78.67) v1(60.07,85.67) v1(60.07,84.66) v1(60.07,83.64) v1(60.07,82.63) v1(60.07,81.61) v1(61.09,85.67) v1(61.09,84.66) v1(61.09,83.64) v1(61.09,82.63) v1(61.09,81.61)
PHASE_W: length 32.8
  Top Layer w0.635: v1(71.43,72.57) 71.43,70.63 C28.2 74.55,69.47 75.44,68.58 75.44,64.39 76.58,63.25 R40.6 ; v1(69.85,66.04) 68.22,66.04 C33.1 ; R60.2 91.84,74.91 89.1,77.65 v1(86.66,77.65)
  Bottom Layer w0.635: v1(71.43,72.57) 71.43,67.61 v1(69.85,66.04)
  vias: v1(69.39,76.64) v1(69.39,75.62) v1(69.39,74.6) v1(70.41,76.64) v1(70.41,75.62) v1(70.41,74.6) v1(71.43,76.64) v1(71.43,75.62) v1(71.43,74.6) v1(72.44,76.64) v1(72.44,75.62) v1(72.44,74.6) v1(73.46,76.64) v1(73.46,75.62) v1(73.46,74.6) v1(74.47,76.64) v1(74.47,75.62) v1(74.47,74.6) v1(75.49,76.64) v1(75.49,75.62) v1(76.5,76.64) v1(76.5,75.62) v1(77.52,76.64) v1(77.52,75.62) v1(78.54,77.65) v1(78.54,76.64) v1(78.54,75.62) v1(79.55,78.67) v1(79.55,77.65) v1(79.55,76.64) v1(79.55,75.62) v1(80.57,78.67) v1(80.57,77.65) v1(80.57,76.64) v1(80.57,75.62) v1(80.86,85.67) v1(80.86,84.66) v1(80.86,83.64) v1(80.86,82.63) v1(80.86,81.61) v1(81.59,78.67) v1(81.59,77.65) v1(81.59,76.64) v1(81.59,75.62) v1(81.88,85.67) v1(81.88,84.66) v1(81.88,83.64) v1(81.88,82.63) v1(81.88,81.61) v1(82.6,78.67) v1(82.6,77.65) v1(82.6,76.64) v1(82.6,75.62) v1(82.9,85.67) v1(82.9,84.66) v1(82.9,83.64) v1(82.9,82.63) v1(82.9,81.61) v1(83.62,78.67) v1(83.62,77.65) v1(83.62,76.64) v1(83.62,75.62) v1(83.91,85.67) v1(83.91,84.66) v1(83.91,83.64) v1(83.91,82.63) v1(83.91,81.61) v1(84.63,78.67) v1(84.63,77.65) v1(84.63,76.64) v1(84.63,75.62) v1(84.93,85.67) v1(84.93,84.66) v1(84.93,83.64) v1(84.93,82.63) v1(84.93,81.61) v1(85.65,78.67) v1(85.65,77.65) v1(85.65,76.64) v1(85.94,85.67) v1(85.94,84.66) v1(85.94,83.64) v1(85.94,82.63) v1(85.94,81.61) v1(86.66,78.67) v1(86.96,85.67) v1(86.96,84.66) v1(86.96,83.64) v1(86.96,82.63) v1(86.96,81.61) v1(87.68,78.67) v1(87.98,85.67) v1(87.98,84.66) v1(87.98,83.64) v1(87.98,82.63) v1(87.98,81.61) v1(88.99,85.67) v1(88.99,84.66) v1(88.99,83.64) v1(88.99,82.63) v1(88.99,81.61)
PPM: length 37.3
  Top Layer w0.254: R87.2 86.45,30.37 C81.1 82.41,30.37 76.71,36.07 70.23,36.07 68.96,37.34 68.96,38.73 68.71,38.99 57.28,38.99 55.27,36.98 55.27,36.05
RESET: length 38.7
  Top Layer w0.254: U18.7 52.21,31.1 v1(52.32,30.99) ; v1(60.58,20.7) 60.96,20.32 60.96,13.19 60.02,12.25 58.35,12.25 57.66,11.56 57.66,10.56 R61.2 57.78,10.4 C58.1 57.78,4.47 RESET.2
  Inner1 w0.254: v1(52.32,30.99) 56.64,30.99 60.58,27.05 v1(60.58,20.7)
RXD: length 48.3
  Top Layer w0.254: v1(54.17,38.1) 53.77,37.69 53.77,36.05 ; U29.4 v1(83.69,18.54)
  Inner2 w0.254: v1(54.17,38.1) 61.98,38.1 63.5,36.58 63.5,25.91 67.82,21.59 78.99,21.59 80.14,20.45 83.06,20.45 83.69,19.81 v1(83.69,18.54)
TXD: length 53.8
  Top Layer w0.254: U29.1 87.5,18.53 v1(87.49,18.54) ; v1(55.51,38.99) 53.59,38.99 53.27,38.66 53.27,36.05
  Inner2 w0.254: v1(55.51,38.99) 62.1,38.99 64.26,36.83 64.26,26.29 66.17,24.38 78.87,24.38 81.66,21.59 85.72,21.59 87.49,19.82 v1(87.49,18.54)
U_HIN: length 106.2
  Top Layer w0.254: H2.8 95.12,26.42 91.69,22.99 85.34,22.99 79.75,28.58 v1(76.68,28.58) R73.1 ; v1(19.3,51.69) R20.2
  Inner1 w0.254: v1(76.68,28.58) 76.68,42.94 75.54,44.07 47.37,44.07 43.31,48.13 22.22,48.13 19.3,51.05 v1(19.3,51.69)
U_HO: length 3.6
  Top Layer w0.635: R41.1 19.3,63 R20.7
U_LIN: length 111.5
  Top Layer w0.254: v1(20.57,51.69) R20.3 ; R76.1 v1(77.69,20.2) 87.88,20.2 89.41,18.67 96.52,18.67 H2.5
  Inner1 w0.254: v1(77.69,20.2) 77.69,43.34 76.07,44.96 48.01,44.96 43.94,49.02 22.61,49.02 20.57,51.05 v1(20.57,51.69)
U_LO: length 3.1
  Top Layer w0.635: R42.1 R20.5
U_VD: length 60.8
  Top Layer w0.254: v1(40.51,24.89) 41.53,23.88 R79.1 ; R57.2 37.35,67.67 v1(37.59,67.44) 37.59,64.64 36.45,63.5 36.45,51.31 v1(35.81,50.67)
  Top Layer w0.635: R59.1 35.94,67.85 35.96,67.84
  Inner2 w0.254: v1(35.81,50.67) 33.4,48.26 33.4,25.91 34.42,24.89 v1(40.51,24.89) 41.28,25.65 H3.3
UH: length 10.9
  Top Layer w0.254: U18.41 69.22,30.6 69.47,30.35 69.47,28.96 69.84,28.58 R73.2
UL: length 14.3
  Top Layer w0.254: R76.2 69.72,20.2 68.71,21.21 68.71,25.02 66.62,27.1 U18.34
UV: length 17.2
  Top Layer w0.254: R79.2 41.53,18.8 41.91,18.41 43.05,18.41 43.31,18.67 43.31,24.64 46.27,27.6 U18.14
V_HIN: length 82.5
  Top Layer w0.254: H2.9 91.44,23.75 85.98,23.75 v1(78.74,30.99) 78.35,31.38 R74.1 ; v1(47.5,51.69) 47.5,55.55
  Inner1 w0.254: v1(78.74,30.99) 78.74,44.7 77.6,45.85 48.77,45.85 47.5,47.12 v1(47.5,51.69)
V_HO: length 3.8
  Top Layer w0.635: R44.1 47.5,63 R39.7
V_LIN: length 86
  Top Layer w0.254: v1(48.77,51.69) 48.77,55.55 ; R77.1 74.03,22.87 v1(78.78,22.87) 80,22.87 81.53,21.34 H2.6
  Inner1 w0.254: v1(78.78,22.87) 79.76,23.84 79.76,44.96 77.98,46.74 49.5,46.74 48.77,47.47 v1(48.77,51.69)
V_LO: length 3.2
  Top Layer w0.635: R43.1 R39.5
V_VD: length 83.9
  Top Layer w0.254: R56.2 65.29,67.67 v1(65.53,67.44) 65.53,64.64 64.39,63.5 64.39,51.18 v1(63.88,50.67) ; v1(38.35,25.65) 38.74,25.27 R80.1
  Top Layer w0.635: R32.1 R56.2
  Inner2 w0.254: H3.2 38.35,27.81 v1(38.35,25.65) 34.42,25.65 33.91,26.16 33.91,46.48 38.1,50.67 v1(63.88,50.67)
VH: length 9.4
  Top Layer w0.254: U18.42 61.71,31.12 69.47,31.12 69.73,31.38 R74.2
VL: length 12.4
  Top Layer w0.254: U18.35 67.14,27.6 69.34,25.4 69.34,23.37 69.72,22.99 R77.2
VSUPPLY: length 28.8
  Top Layer w0.635: C60.2 5.3,15.14 3.94,16.51 3.94,20.32 4.6,20.99 U21.2
  Top Layer w1.27: U12.1 10.16,2.67 6.99,5.83 C59.2 C60.2
  vias: v1(1.55,45.9) v1(1.55,44.89) v1(1.55,43.87) v1(1.55,42.86) v1(1.55,41.84) v1(1.55,40.82) v1(1.55,39.81) v1(1.55,38.79) v1(1.55,37.78) v1(1.55,36.76) v1(1.55,35.74) v1(1.55,34.73) v1(1.55,33.71) v1(1.55,32.69) v1(1.55,31.68) v1(1.55,30.66) v1(1.55,29.65) v1(1.55,28.63) v1(1.55,27.62) v1(1.55,26.6) v1(1.55,25.58) v1(1.55,24.57) v1(1.55,23.55) v1(1.55,22.53) v1(1.55,21.52) v1(1.55,20.5) v1(1.55,19.49) v1(1.55,18.47) v1(1.55,17.46) v1(1.55,16.44) v1(1.55,15.42) v1(1.55,14.41) v1(1.55,13.39) v1(1.55,12.38) v1(1.55,11.36) v1(1.55,10.34) v1(1.55,9.33) v1(1.78,85.98) v1(1.78,84.96) v1(1.78,83.95) v1(1.78,82.93) v1(1.78,81.92) v1(1.78,80.9) v1(1.78,79.88) v1(1.78,78.87) v1(1.78,77.85) v1(1.78,76.83) v1(1.78,75.82) v1(1.78,74.8) v1(1.78,73.79) v1(1.78,72.77) v1(1.78,71.75) v1(1.78,70.74) v1(1.78,69.72) v1(1.78,68.71) v1(1.78,67.69) v1(1.78,66.67) v1(1.78,65.66) v1(1.78,64.64) v1(1.78,63.63) v1(1.78,62.61) v1(1.78,61.59) v1(1.78,60.58) v1(1.78,59.56) v1(1.78,58.55) v1(1.78,57.53) v1(1.78,56.52) v1(1.78,55.5) v1(1.78,54.48) v1(1.78,53.47) v1(1.78,52.45) v1(1.78,51.44) v1(1.78,50.42) v1(1.78,49.4) v1(1.78,48.39) v1(1.78,47.37) v1(2.57,45.9) v1(2.57,44.89) v1(2.57,43.87) v1(2.57,42.86) v1(2.57,41.84) v1(2.57,40.82) v1(2.57,39.81) v1(2.57,38.79) v1(2.57,37.78) v1(2.57,36.76) v1(2.57,35.74) v1(2.57,34.73) v1(2.57,33.71) v1(2.57,32.69) v1(2.57,31.68) v1(2.57,30.66) v1(2.57,29.65) v1(2.57,28.63) v1(2.57,27.62) v1(2.57,26.6) v1(2.57,25.58) v1(2.57,24.57) v1(2.57,23.55) v1(2.57,22.53) v1(2.57,21.52) v1(2.57,20.5) v1(2.57,19.49) v1(2.57,18.47) v1(2.57,17.46) v1(2.57,16.44) v1(2.57,15.42) v1(2.57,14.41) v1(2.57,13.39) v1(2.57,12.38) v1(2.57,11.36) v1(2.57,10.34) v1(2.57,9.33) v1(2.57,8.31) v1(2.79,87) v1(2.79,85.98) v1(2.79,84.96) v1(2.79,83.95) v1(2.79,82.93) v1(2.79,81.92) v1(2.79,80.9) v1(2.79,79.88) v1(2.79,78.87) v1(2.79,77.85) v1(2.79,76.83) v1(2.79,75.82) v1(2.79,74.8) v1(2.79,73.79) v1(2.79,72.77) v1(2.79,71.75) v1(2.79,70.74) v1(2.79,69.72) v1(2.79,68.71) v1(2.79,67.69) v1(2.79,66.67) v1(2.79,65.66) v1(2.79,64.64) v1(2.79,63.63) v1(2.79,62.61) v1(2.79,61.59) v1(2.79,60.58) v1(2.79,59.56) v1(2.79,58.55) v1(2.79,57.53) v1(2.79,56.52) v1(2.79,55.5) v1(2.79,54.48) v1(2.79,53.47) v1(2.79,52.45) v1(2.79,51.44) v1(2.79,50.42) v1(2.79,49.4) v1(2.79,48.39) v1(2.79,47.37) v1(3.58,45.9) v1(3.58,44.89) v1(3.58,43.87) v1(3.58,42.86) v1(3.58,41.84) v1(3.58,40.82) v1(3.58,39.81) v1(3.58,38.79) v1(3.58,37.78) v1(3.58,36.76) v1(3.58,35.74) v1(3.58,14.41) v1(3.58,13.39) v1(3.58,12.38) v1(3.58,11.36) v1(3.58,10.34) v1(3.58,9.33) v1(3.58,8.31) v1(3.58,7.29) v1(3.81,88.01) v1(3.81,87) v1(3.81,85.98) v1(3.81,84.96) v1(3.81,83.95) v1(3.81,82.93) v1(3.81,81.92) v1(3.81,80.9) v1(3.81,79.88) v1(3.81,78.87) v1(3.81,77.85) v1(3.81,76.83) v1(3.81,75.82) v1(3.81,74.8) v1(3.81,73.79) v1(3.81,72.77) v1(3.81,71.75) v1(3.81,70.74) v1(3.81,69.72) v1(3.81,68.71) v1(3.81,67.69) v1(3.81,66.67) v1(3.81,65.66) v1(3.81,64.64) v1(3.81,63.63) v1(3.81,62.61) v1(3.81,61.59) v1(3.81,60.58) v1(3.81,59.56) v1(3.81,58.55) v1(3.81,57.53) v1(3.81,56.52) v1(3.81,55.5) v1(3.81,54.48) v1(3.81,53.47) v1(3.81,52.45) v1(3.81,51.44) v1(3.81,50.42) v1(3.81,49.4) v1(3.81,48.39) v1(3.81,47.37) v1(4.6,45.9) v1(4.6,44.89) v1(4.6,43.87) v1(4.6,42.86) v1(4.6,41.84) v1(4.6,40.82) v1(4.6,39.81) v1(4.6,38.79) v1(4.6,37.78) v1(4.6,36.76) v1(4.6,13.39) v1(4.6,12.38) v1(4.6,11.36) v1(4.6,10.34) v1(4.6,9.33) v1(4.6,8.31) v1(4.6,7.29) v1(4.6,6.28) v1(4.83,89.03) v1(4.83,88.01) v1(4.83,87) v1(4.83,85.98) v1(4.83,84.96) v1(4.83,83.95) v1(4.83,82.93) v1(4.83,81.92) v1(4.83,80.9) v1(4.83,79.88) v1(4.83,78.87) v1(4.83,77.85) v1(4.83,76.83) v1(4.83,75.82) v1(4.83,74.8) v1(4.83,73.79) v1(4.83,72.77) v1(4.83,71.75) v1(4.83,70.74) v1(4.83,69.72) v1(4.83,68.71) v1(4.83,67.69) v1(4.83,66.67) v1(4.83,65.66) v1(4.83,64.64) v1(4.83,63.63) v1(4.83,62.61) v1(4.83,61.59) v1(4.83,60.58) v1(4.83,59.56) v1(4.83,58.55) v1(4.83,57.53) v1(4.83,56.52) v1(4.83,55.5) v1(4.83,54.48) v1(4.83,53.47) v1(4.83,52.45) v1(4.83,51.44) v1(4.83,50.42) v1(4.83,49.4) v1(4.83,48.39) v1(4.83,47.37) v1(5.62,9.33) v1(5.62,8.31) v1(5.62,7.29) v1(5.62,6.28) v1(5.62,5.26) v1(5.84,90.04) v1(5.84,89.03) v1(5.84,88.01) v1(5.84,87) v1(5.84,85.98) v1(5.84,84.96) v1(5.84,83.95) v1(5.84,82.93) v1(5.84,81.92) v1(5.84,80.9) v1(5.84,79.88) v1(6.63,8.31) v1(6.63,7.29) v1(6.63,6.28) v1(6.63,5.26) v1(6.63,4.25) v1(6.86,91.06) v1(6.86,90.04) v1(6.86,89.03) v1(6.86,88.01) v1(6.86,87) v1(6.86,85.98) v1(6.86,84.96) v1(6.86,83.95) v1(6.86,82.93) v1(6.86,81.92) v1(6.86,80.9) v1(7.65,7.29) v1(7.65,6.28) v1(7.65,5.26) v1(7.65,4.25) v1(7.65,3.23) v1(7.87,92.08) v1(7.87,91.06) v1(7.87,90.04) v1(7.87,89.03) v1(7.87,88.01) v1(7.87,87) v1(7.87,85.98) v1(7.87,84.96) v1(7.87,83.95) v1(7.87,82.93) v1(7.87,81.92) v1(7.87,80.9) v1(8.66,6.28) v1(8.66,5.26) v1(8.66,4.25) v1(8.66,3.23) v1(8.66,2.22) v1(8.89,93.09) v1(8.89,92.08) v1(8.89,91.06) v1(8.89,90.04) v1(8.89,89.03) v1(8.89,88.01) v1(8.89,87) v1(8.89,85.98) v1(8.89,84.96) v1(8.89,83.95) v1(8.89,82.93) v1(8.89,81.92) v1(8.89,80.9) v1(9.68,5.26) v1(9.68,4.25) v1(9.68,3.23) v1(9.68,2.22) v1(9.91,93.09) v1(10.7,4.25) v1(10.7,3.23) v1(10.7,2.22) v1(11.05,85.67) v1(11.05,84.66) v1(11.05,83.64) v1(11.05,82.63) v1(11.05,81.61) v1(11.1,92.02) v1(11.1,91.01) v1(11.1,89.99) v1(11.1,88.98) v1(11.71,3.23) v1(11.71,2.22) v1(12.12,93.04) v1(12.12,92.02) v1(12.12,91.01) v1(12.12,89.99) v1(12.12,88.98) v1(12.06,85.67) v1(12.06,84.66) v1(12.06,83.64) v1(12.06,82.63) v1(12.06,81.61) v1(12.73,3.23) v1(12.73,2.22) v1(13.13,93.04) v1(13.13,92.02) v1(13.13,91.01) v1(13.13,89.99) v1(13.13,88.98) v1(13.08,85.67) v1(13.08,84.66) v1(13.08,83.64) v1(13.08,82.63) v1(13.08,81.61) v1(14.15,93.04) v1(14.15,92.02) v1(14.15,91.01) v1(14.15,89.99) v1(14.15,88.98) v1(14.1,85.67) v1(14.1,84.66) v1(14.1,83.64) v1(14.1,82.63) v1(14.1,81.61) v1(15.11,85.67) v1(15.11,84.66) v1(15.11,83.64) v1(15.11,82.63) v1(15.11,81.61) v1(15.16,93.04) v1(15.16,92.02) v1(15.16,91.01) v1(15.16,89.99) v1(15.16,88.98) v1(15.16,87.96) v1(16.13,85.67) v1(16.13,84.66) v1(16.13,83.64) v1(16.13,82.63) v1(16.13,81.61) v1(16.18,93.04) v1(16.18,92.02) v1(16.18,91.01) v1(16.18,89.99) v1(16.18,88.98) v1(17.14,85.67) v1(17.14,84.66) v1(17.14,83.64) v1(17.14,82.63) v1(17.14,81.61) v1(17.2,93.04) v1(17.2,92.02) v1(17.2,91.01) v1(17.2,89.99) v1(17.2,88.98) v1(18.21,93.04) v1(18.21,92.02) v1(18.21,91.01) v1(18.21,89.99) v1(18.21,88.98) v1(18.16,85.67) v1(18.16,84.66) v1(18.16,83.64) v1(18.16,82.63) v1(18.16,81.61) v1(19.23,93.04) v1(19.23,92.02) v1(19.23,91.01) v1(19.23,89.99) v1(19.23,88.98) v1(19.18,85.67) v1(19.18,84.66) v1(19.18,83.64) v1(19.18,82.63) v1(19.18,81.61) v1(20.24,93.04) v1(20.24,92.02) v1(20.24,91.01) v1(20.24,89.99) v1(21.26,93.04) v1(21.26,92.02) v1(21.26,91.01) v1(21.26,89.99) v1(22.28,93.04) v1(22.28,92.02) v1(22.28,91.01) v1(22.28,89.99) v1(37.52,93.04) v1(37.52,92.02) v1(37.52,91.01) v1(37.52,89.99) v1(38.53,93.04) v1(38.53,92.02) v1(38.53,91.01) v1(38.53,89.99) v1(38.53,88.98) v1(38.99,85.67) v1(38.99,84.66) v1(38.99,83.64) v1(38.99,82.63) v1(38.99,81.61) v1(39.55,93.04) v1(39.55,92.02) v1(39.55,91.01) v1(39.55,89.99) v1(39.55,88.98) v1(40,85.67) v1(40,84.66) v1(40,83.64) v1(40,82.63) v1(40,81.61) v1(40.56,93.04) v1(40.56,92.02) v1(40.56,91.01) v1(40.56,89.99) v1(40.56,88.98) v1(41.02,85.67) v1(41.02,84.66) v1(41.02,83.64) v1(41.02,82.63) v1(41.02,81.61) v1(41.58,93.04) v1(41.58,92.02) v1(41.58,91.01) v1(41.58,89.99) v1(41.58,88.98) v1(42.04,85.67) v1(42.04,84.66) v1(42.04,83.64) v1(42.04,82.63) v1(42.04,81.61) v1(42.6,93.04) v1(42.6,92.02) v1(42.6,91.01) v1(42.6,89.99) v1(42.6,88.98) v1(43.05,85.67) v1(43.05,84.66) v1(43.05,83.64) v1(43.05,82.63) v1(43.05,81.61) v1(43.61,93.04) v1(43.61,92.02) v1(43.61,91.01) v1(43.61,89.99) v1(43.61,88.98) v1(44.07,85.67) v1(44.07,84.66) v1(44.07,83.64) v1(44.07,82.63) v1(44.07,81.61) v1(44.63,93.04) v1(44.63,92.02) v1(44.63,91.01) v1(44.63,89.99) v1(44.63,88.98) v1(45.09,85.67) v1(45.09,84.66) v1(45.09,83.64) v1(45.09,82.63) v1(45.09,81.61) v1(45.64,93.04) v1(45.64,92.02) v1(45.64,91.01) v1(45.64,89.99) v1(45.64,88.98) v1(46.1,85.67) v1(46.1,84.66) v1(46.1,83.64) v1(46.1,82.63) v1(46.1,81.61) v1(46.66,93.04) v1(46.66,92.02) v1(46.66,91.01) v1(46.66,89.99) v1(46.66,88.98) v1(47.12,85.67) v1(47.12,84.66) v1(47.12,83.64) v1(47.12,82.63) v1(47.12,81.61) v1(47.68,93.04) v1(47.68,92.02) v1(47.68,91.01) v1(47.68,89.99) v1(47.68,88.98) v1(48.69,93.04) v1(48.69,92.02) v1(48.69,91.01) v1(48.69,89.99) v1(63.93,93.04) v1(63.93,92.02) v1(63.93,91.01) v1(63.93,89.99) v1(64.95,93.04) v1(64.95,92.02) v1(64.95,91.01) v1(64.95,89.99) v1(65.96,93.04) v1(65.96,92.02) v1(65.96,91.01) v1(65.96,89.99) v1(66.89,85.67) v1(66.89,84.66) v1(66.89,83.64) v1(66.89,82.63) v1(66.89,81.61) v1(66.98,93.04) v1(66.98,92.02) v1(66.98,91.01) v1(66.98,89.99) v1(66.98,88.98) v1(67.91,85.67) v1(67.91,84.66) v1(67.91,83.64) v1(67.91,82.63) v1(67.91,81.61) v1(68,93.04) v1(68,92.02) v1(68,91.01) v1(68,89.99) v1(68,88.98) v1(68.93,85.67) v1(68.93,84.66) v1(68.93,83.64) v1(68.93,82.63) v1(68.93,81.61) v1(69.01,93.04) v1(69.01,92.02) v1(69.01,91.01) v1(69.01,89.99) v1(69.01,88.98) v1(69.94,85.67) v1(69.94,84.66) v1(69.94,83.64) v1(69.94,82.63) v1(69.94,81.61) v1(70.03,93.04) v1(70.03,92.02) v1(70.03,91.01) v1(70.03,89.99) v1(70.03,88.98) v1(71.04,93.04) v1(71.04,92.02) v1(71.04,91.01) v1(71.04,89.99) v1(71.04,88.98) v1(71.04,87.96) v1(70.96,85.67) v1(70.96,84.66) v1(70.96,83.64) v1(70.96,82.63) v1(70.96,81.61) v1(71.97,85.67) v1(71.97,84.66) v1(71.97,83.64) v1(71.97,82.63) v1(71.97,81.61) v1(72.06,93.04) v1(72.06,92.02) v1(72.06,91.01) v1(72.06,89.99) v1(72.06,88.98) v1(72.99,85.67) v1(72.99,84.66) v1(72.99,83.64) v1(72.99,82.63) v1(72.99,81.61) v1(73.08,93.04) v1(73.08,92.02) v1(73.08,91.01) v1(73.08,89.99) v1(73.08,88.98) v1(74.01,85.67) v1(74.01,84.66) v1(74.01,83.64) v1(74.01,82.63) v1(74.01,81.61) v1(74.09,93.04) v1(74.09,92.02) v1(74.09,91.01) v1(74.09,89.99) v1(74.09,88.98) v1(75.02,85.67) v1(75.02,84.66) v1(75.02,83.64) v1(75.02,82.63) v1(75.02,81.61) v1(75.11,93.04) v1(75.11,92.02) v1(75.11,91.01) v1(75.11,89.99) v1(75.11,88.98)
VV: length 20.4
  Top Layer w0.254: U18.15 46.66,27.1 44.32,24.76 44.32,18.54 43.69,17.91 39.5,17.91 38.74,18.67 R80.2
W_HIN: length 60.4
  Top Layer w0.254: v1(75.31,52.83) R40.2 ; H2.10 94.87,31.5 94.62,31.24 94.62,28.07 91.06,24.51 86.49,24.51 v1(80.77,30.23) 76.83,34.17 R75.1
  Inner1 w0.254: v1(80.77,30.23) 80.77,45.21 78.61,47.37 76.52,47.37 75.31,48.58 v1(75.31,52.83)
W_HO: length 3.6
  Top Layer w0.635: 74.04,64.27 74.04,64.01 75.31,62.74 R40.7
W_LIN: length 58.7
  Top Layer w0.254: H2.7 95,22.22 84.2,22.22 80.76,25.66 v1(80.76,25.79) R78.1 ; v1(76.58,52.83) R40.3
  Inner1 w0.254: v1(76.58,52.83) 76.58,48.56 77.01,48.13 79.12,48.13 81.79,45.47 81.79,26.81 v1(80.76,25.79)
W_LO: length 3.1
  Top Layer w0.635: R46.1 R40.5
W_VD: length 107.3
  Top Layer w0.254: R58.2 93.15,67.67 v1(93.46,67.37) 93.46,64.63 92.2,63.37 92.2,50.55 v1(91.19,49.53) ; R81.1 v1(35.94,26.42)
  Top Layer w0.635: R60.1 91.84,67.84 91.82,67.82
  Inner2 w0.254: H3.1 36.19,26.67 v1(35.94,26.42) 34.54,26.42 34.42,26.54 34.42,45.34 38.61,49.53 v1(91.19,49.53)
WH: length 11.4
  Top Layer w0.254: U18.43 69.19,31.6 69.47,31.88 69.47,33.78 69.86,34.17 R75.2
WL: length 10.2
  Top Layer w0.254: R78.2 69.97,25.79 67.66,28.1 U18.36
WV: length 23.6
  Top Layer w0.254: R81.2 36.02,19.66 36.02,18.72 37.34,17.4 44.57,17.4 45.21,18.04 45.21,24.76 47.05,26.6 U18.16
$1N18971: length 8.5
  Top Layer w0.635: C31.2 12.19,61.98 13.36,60.81 D4.2 15.09,61.16 R20.8
$1N19331: length 11.9
  Top Layer w0.635: R41.2 16.26,65.78 13.52,68.52 C30.1 11.81,69.47 11.3,69.98 11.3,72.83
$1N19521: length 9.5
  Top Layer w0.635: 25.26,72.83 23.55,72.83 22.54,71.81 C25.1 22.54,67.62 21.84,66.93 R42.2
$1N20357: length 12.1
  Top Layer w0.635: 39.24,72.83 39.24,70.1 39.88,69.47 C29.1 41.46,68.52 44.2,65.78 R44.2
$1N20372: length 9.2
  Top Layer w0.635: R43.2 50.04,67.18 50.48,67.62 C26.1 50.48,71.56 51.63,72.71 53.1,72.71 53.21,72.83
$1N20703: length 11.7
  Top Layer w0.635: 67.15,72.83 67.15,70.27 67.94,69.47 C28.1 69.4,68.57 72.19,65.78 R45.2
$1N20718: length 9.2
  Top Layer w0.635: 81.12,72.83 79.69,72.83 78.42,71.56 C27.1 78.42,67.62 77.85,67.06 R46.2
$1N21329: length 8.5
  Top Layer w0.635: C32.2 40.39,61.85 41.56,60.68 D5.2 43.28,61.03 R39.8
$1N21568: length 8.5
  Top Layer w0.635: R40.8 71.09,61.16 D6.2 69.37,60.81 68.2,61.98 C33.2
$2N2212: length 4.6
  Top Layer w0.254: U18.47 62.69,33.6 64.28,35.19 C79.2
$2N2213: length 7.3
  Top Layer w0.254: C80.2 59.29,24.63 59.27,24.65
$2N3961: length 11.7
  Top Layer w0.254: C77.1 43.99,36.45 44.41,36.03 46.14,36.03 46.39,35.78 46.39,33.11 47.4,32.1 U18.5
$2N3971: length 11.8
  Top Layer w0.254: U18.6 44.6,31.6 42.21,33.99 42.21,34.33 39.95,34.33 C78.1
$2N5800: length 9.5
  Top Layer w0.254: U27.2 86.85,7.75 R84.2 86.23,8.37 U29.7
$2N5978: length 9.5
  Top Layer w0.254: U27.3 84.35,7.75 R84.1 84.96,8.37 U29.6
$2N8796: length 17.5
  Top Layer w0.254: 57.77,24.65 57.78,24.64 v1(57.78,22.48) ; v1(52.71,17.65) 52.63,17.57 R86.1
  Inner1 w0.254: v1(52.71,17.65) 53.59,18.54 55.63,18.54 57.78,20.7 v1(57.78,22.48)
$2N9858: length 3.6
  Top Layer w0.254: H4.3 89.17,32.37 R87.1
$2N11780: length 2.3
  Top Layer w0.254: R90.1 34.86,5.75 ON.1
$3N1194: length 13.1
  Top Layer w0.635: C61.1 21.02,17.09 20.57,16.64 16.38,16.64 16,17.02 16,17.91 12.92,20.99 U21.7
$3N1200: length 22.9
  Top Layer w0.762: U21.8 13.43,22.25 17.53,18.16 C61.2 17.84,22.05 D7.1 16.76,22.73 13.3,26.2 L2.1
$3N1280: length 4.3
  Top Layer w0.635: 12.75,15.11 12.75,17.99 12.29,18.44 U21.5
$3N1335: length 11.1
  Top Layer w0.635: C62.1 15.98,11.63 15.04,11.63 14.35,12.32 14.35,17.91 12.54,19.72 U21.6
$3N1802: length 6.3
  Top Layer w0.635: R72.2 R64.1 18.43,13.32 18.68,13.07 R63.2
$3N2447: length 4.1
  Top Layer w0.508: U23.4 10.47,45.15 R65.2
$3N2564: length 18.3
  Top Layer w0.254: 18.92,34.69 18.53,34.69 17.72,35.5 17.72,37.65 18.29,38.23 20.32,38.23 21.21,39.12 21.21,41.02 20.89,41.34 U24.1 14.92,41.34 14.34,41.92 U23.6
$3N2639: length 12.1
  Top Layer w0.254: U23.1 19.87,43.25 21.72,41.4 21.72,38.86 19.54,36.69 18.92,36.69
$3N2843: length 2.8
  Top Layer w0.254: R83.1 R82.2
$3N2847: length 23.6
  Top Layer w0.254: R82.1 R66.2 16.25,33.79 16.64,33.4 20.57,33.4 21.08,33.91 21.08,37.47 22.22,38.61 22.22,41.66 18.73,45.15 U23.3
$3N3585: length 13.2
  Top Layer w0.254: U25.4 29.71,21.22 30.23,20.7 v1(30.23,20.57) ; v1(27.81,13.08) 26.8,13.08 26.54,12.83 R69.2
  Bottom Layer w0.254: v1(30.23,20.57) 30.48,20.32 30.48,14.22 29.34,13.08 v1(27.81,13.08)
$3N3587: length 10.1
  Top Layer w0.254: 29.35,15.24 28.54,16.05 U26.1 25.53,17.43 25.53,20.96 25.71,21.13 27.2,21.13 27.24,21.09
$3N3594: length 7.4
  Top Layer w0.254: U25.1 27.12,17.71 27.69,17.15 30.99,17.15 31.42,16.71 31.42,15.31 31.35,15.24
$3N3603: length 12.2
  Top Layer w0.254: U25.3 30.23,18.92 33.02,16.13 33.02,13.46 31.88,12.32 R71.1 R70.2
$4N1093: length 8
  Top Layer w0.254: R49.2 R48.2 29.77,55.32 28.96,56.13 27.81,56.13 27.51,56.44 27.51,57.3 U13.6
$4N1104: length 8.1
  Top Layer w0.254: U14.6 55.62,56.27 55.88,56.01 57.4,56.01 57.77,55.64 R51.2 R52.2
$4N1115: length 8.3
  Top Layer w0.254: R55.2 R54.2 85.71,55.52 85.34,55.88 83.69,55.88 83.43,56.14 U15.6

## Copper pours and planes (outline as drawn; the poured copper is in the pictures)
3.3V on Top Layer: 14.22,49.66 42.42,49.66 42.42,13.13 14.22,13.13
3.3V on Bottom Layer: 25.76,14.96 28.05,14.96 28.05,13.82 25.76,13.82
3.3V on Inner2: 14.22,49.66 17.53,49.66 17.53,47.88 14.22,47.88
12V on Top Layer: 4.83,32.89 17.99,32.89 17.99,27.05 4.83,27.05
12V on Bottom Layer: 11.66,54.61 17.99,54.61 17.99,30.61 11.66,30.61
+5V on Bottom Layer: 18.42,40.26 20.7,40.26 20.7,39.12 18.42,39.12
AGND on Top Layer: 59.04,67.45 64.63,67.45 64.63,63.9 59.04,63.9
AGND on Top Layer: 31.1,67.44 36.69,67.44 36.69,63.88 31.1,63.88
AGND on Top Layer: 87,67.44 92.58,67.44 92.58,63.88 87,63.88
AGND on Bottom Layer: 7.32,29.34 23.62,29.34 23.62,9.78 7.32,9.78
AGND on Bottom Layer: 42.42,14.6 43.43,13.59 43.43,9.4 42.42,8.38 25.78,8.38 24.32,9.84 24.32,27.11 21.46,29.97 19.38,29.97 18.69,30.66 18.69,32.28 19.3,32.89 29.46,32.89 30.48,31.88 30.48,21.72 31.12,21.08 31.12,16.76 33.27,14.6
AGND on Bottom Layer: 6.48,67.45 89.53,67.45 89.53,0.89 6.48,0.89
AGND on Bottom Layer: 25.38,36.45 21.53,36.45 20.8,35.72 20.8,33.37 14.13,33.37 13.84,33.66 13.84,45.6 13.96,45.72 18.67,45.72 22.73,41.66 22.73,39.75 23.5,38.99 25.4,38.99 25.78,38.61 25.78,36.85
CUR1 on Top Layer: 24.96,73.72 33.28,73.72 33.28,61.4 24.96,61.4
CUR2 on Top Layer: 52.86,73.72 61.31,73.72 61.31,61.4 52.86,61.4
CUR3 on Top Layer: 80.8,73.72 89.13,73.72 89.13,61.4 80.8,61.4
PHASE_U on Top Layer: 12.13,87.57 34.35,87.57 34.35,71.95 12.13,71.95
PHASE_U on Bottom Layer: 12.13,87.57 34.35,87.57 34.35,71.95 12.13,71.95
PHASE_U on Bottom Layer: 24.51,97.54 46.61,97.54 46.61,80.01 24.51,80.01
PHASE_V on Top Layer: 40.13,87.5 62.36,87.5 62.36,71.88 40.13,71.88
PHASE_V on Bottom Layer: 48.01,97.54 61.72,97.54 61.72,80.14 48.01,80.14
PHASE_V on Bottom Layer: 40.13,87.5 62.36,87.5 62.36,71.88 40.13,71.88
